# EasyEDA Pro project ProPrj_TD4-CPU_.epro, board TD4_CPU v1.1
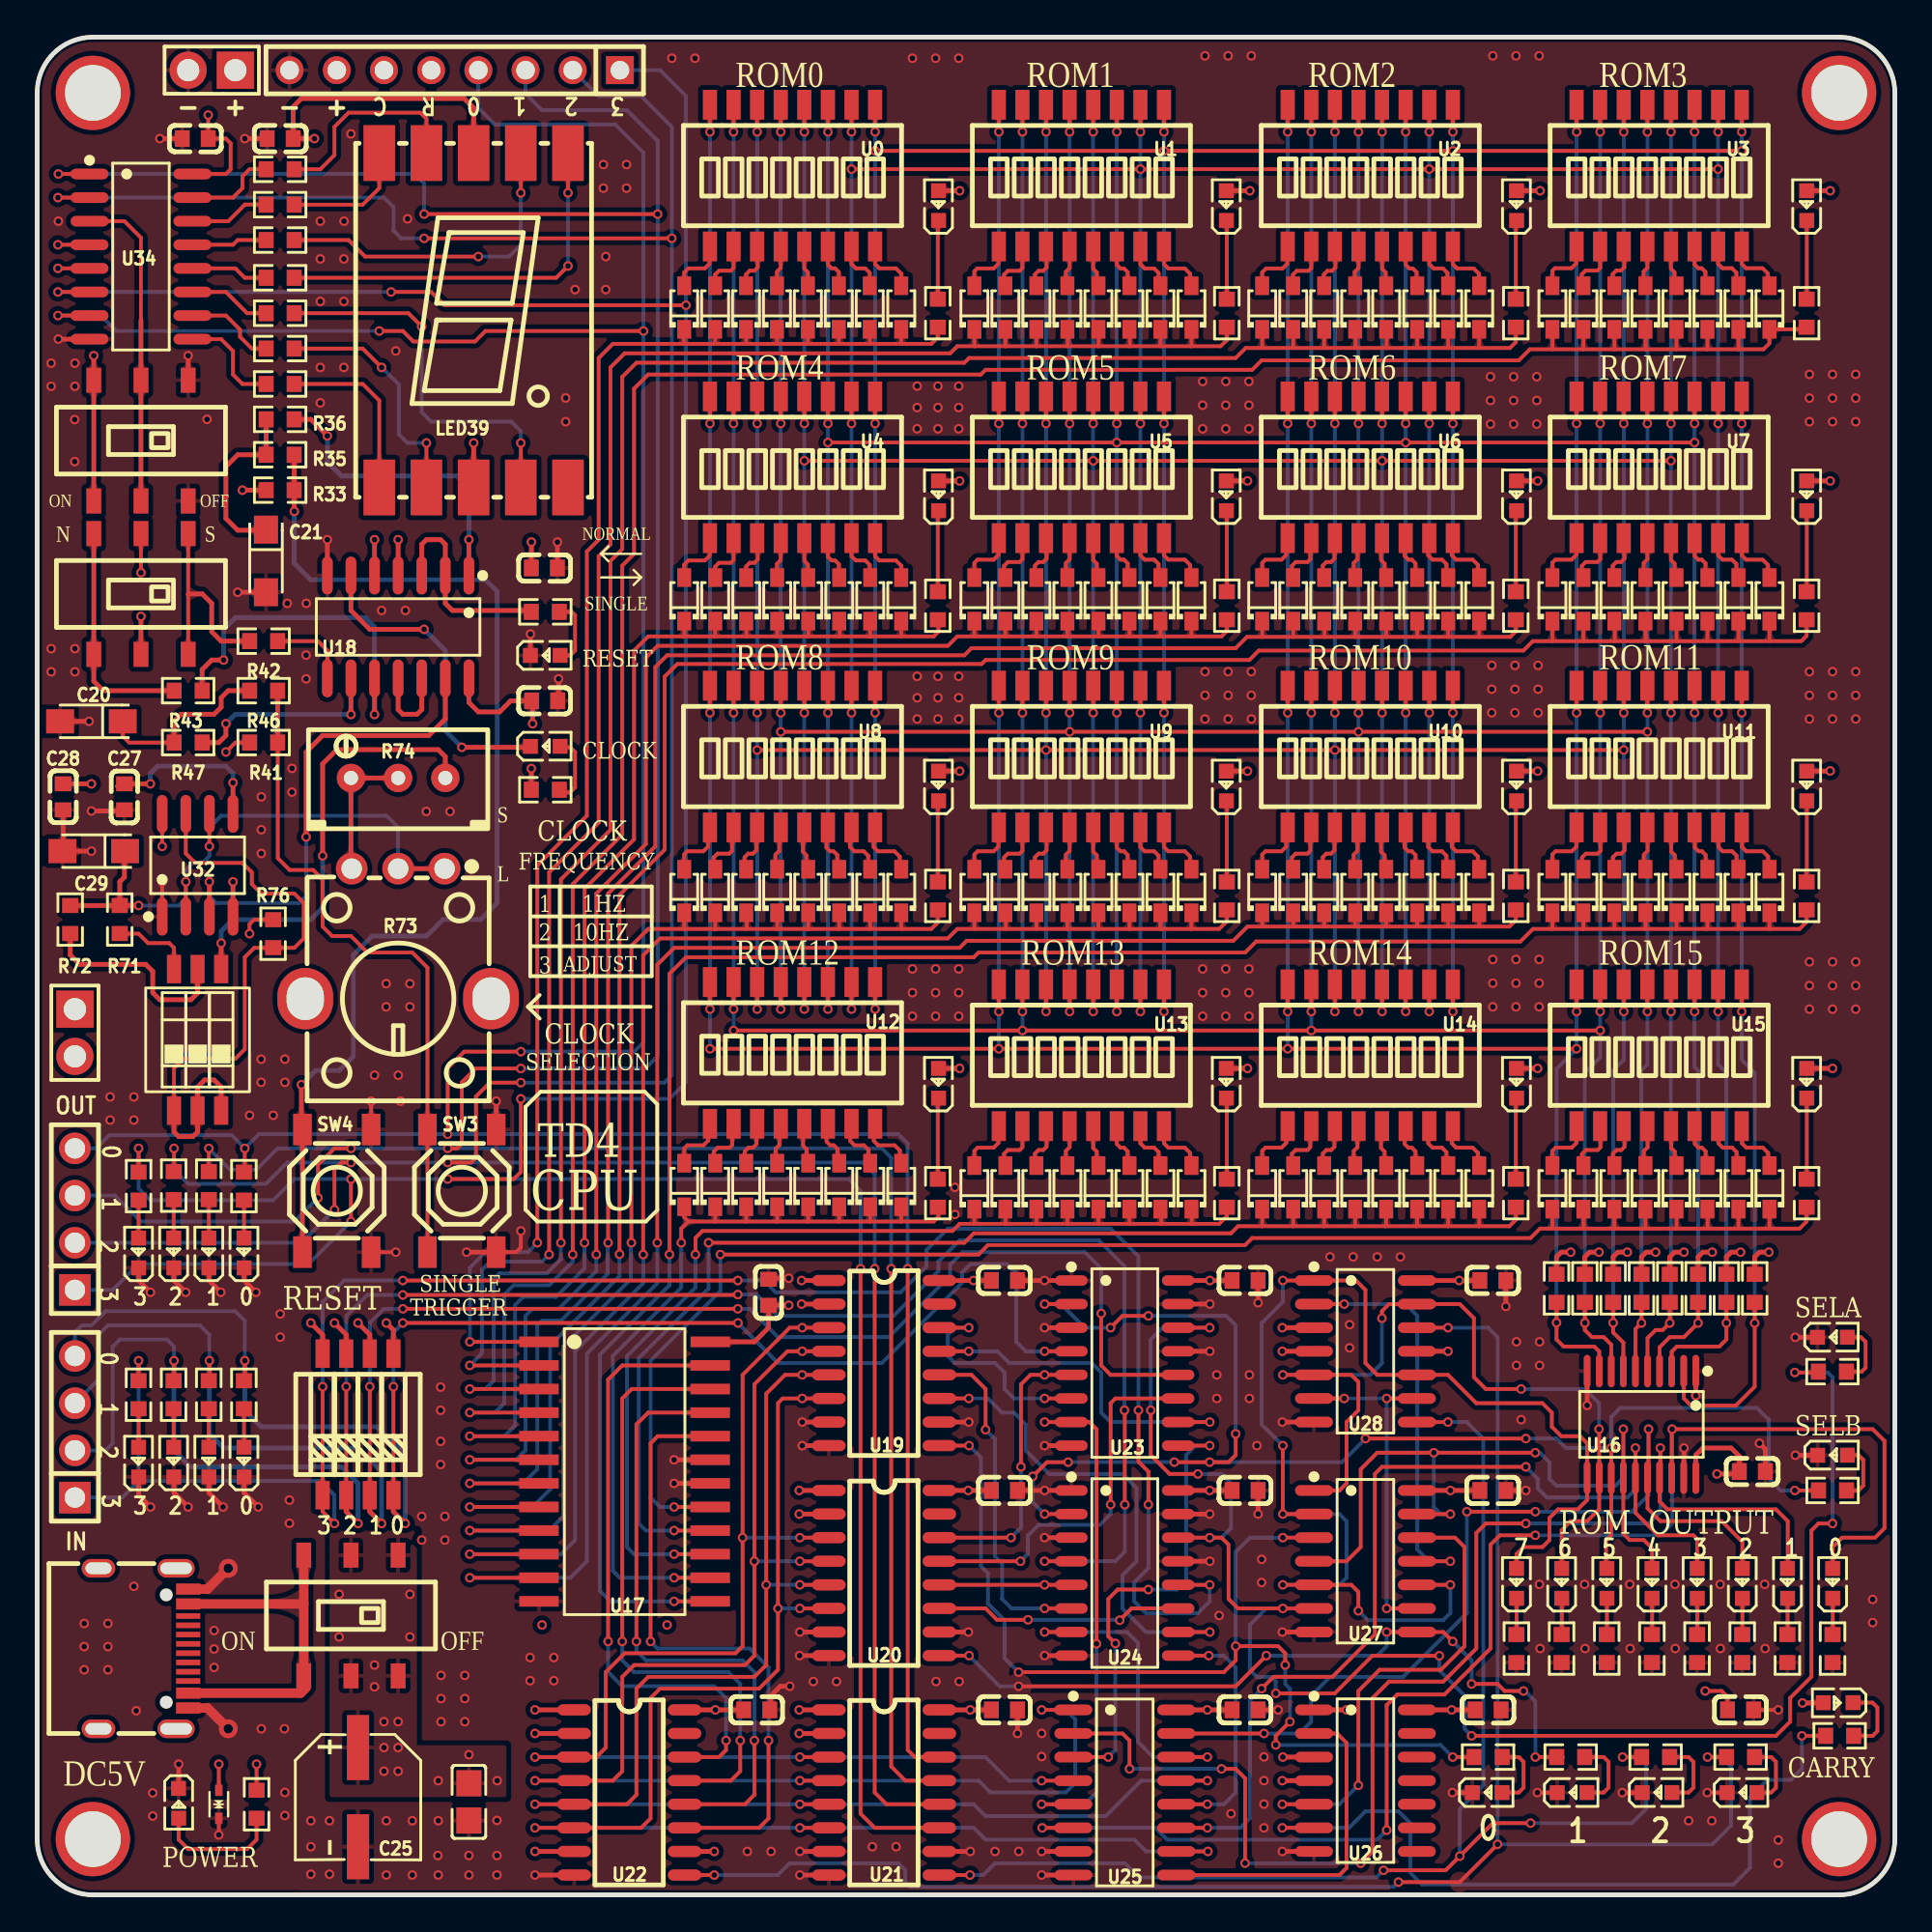
[diagram p3: board, top side]
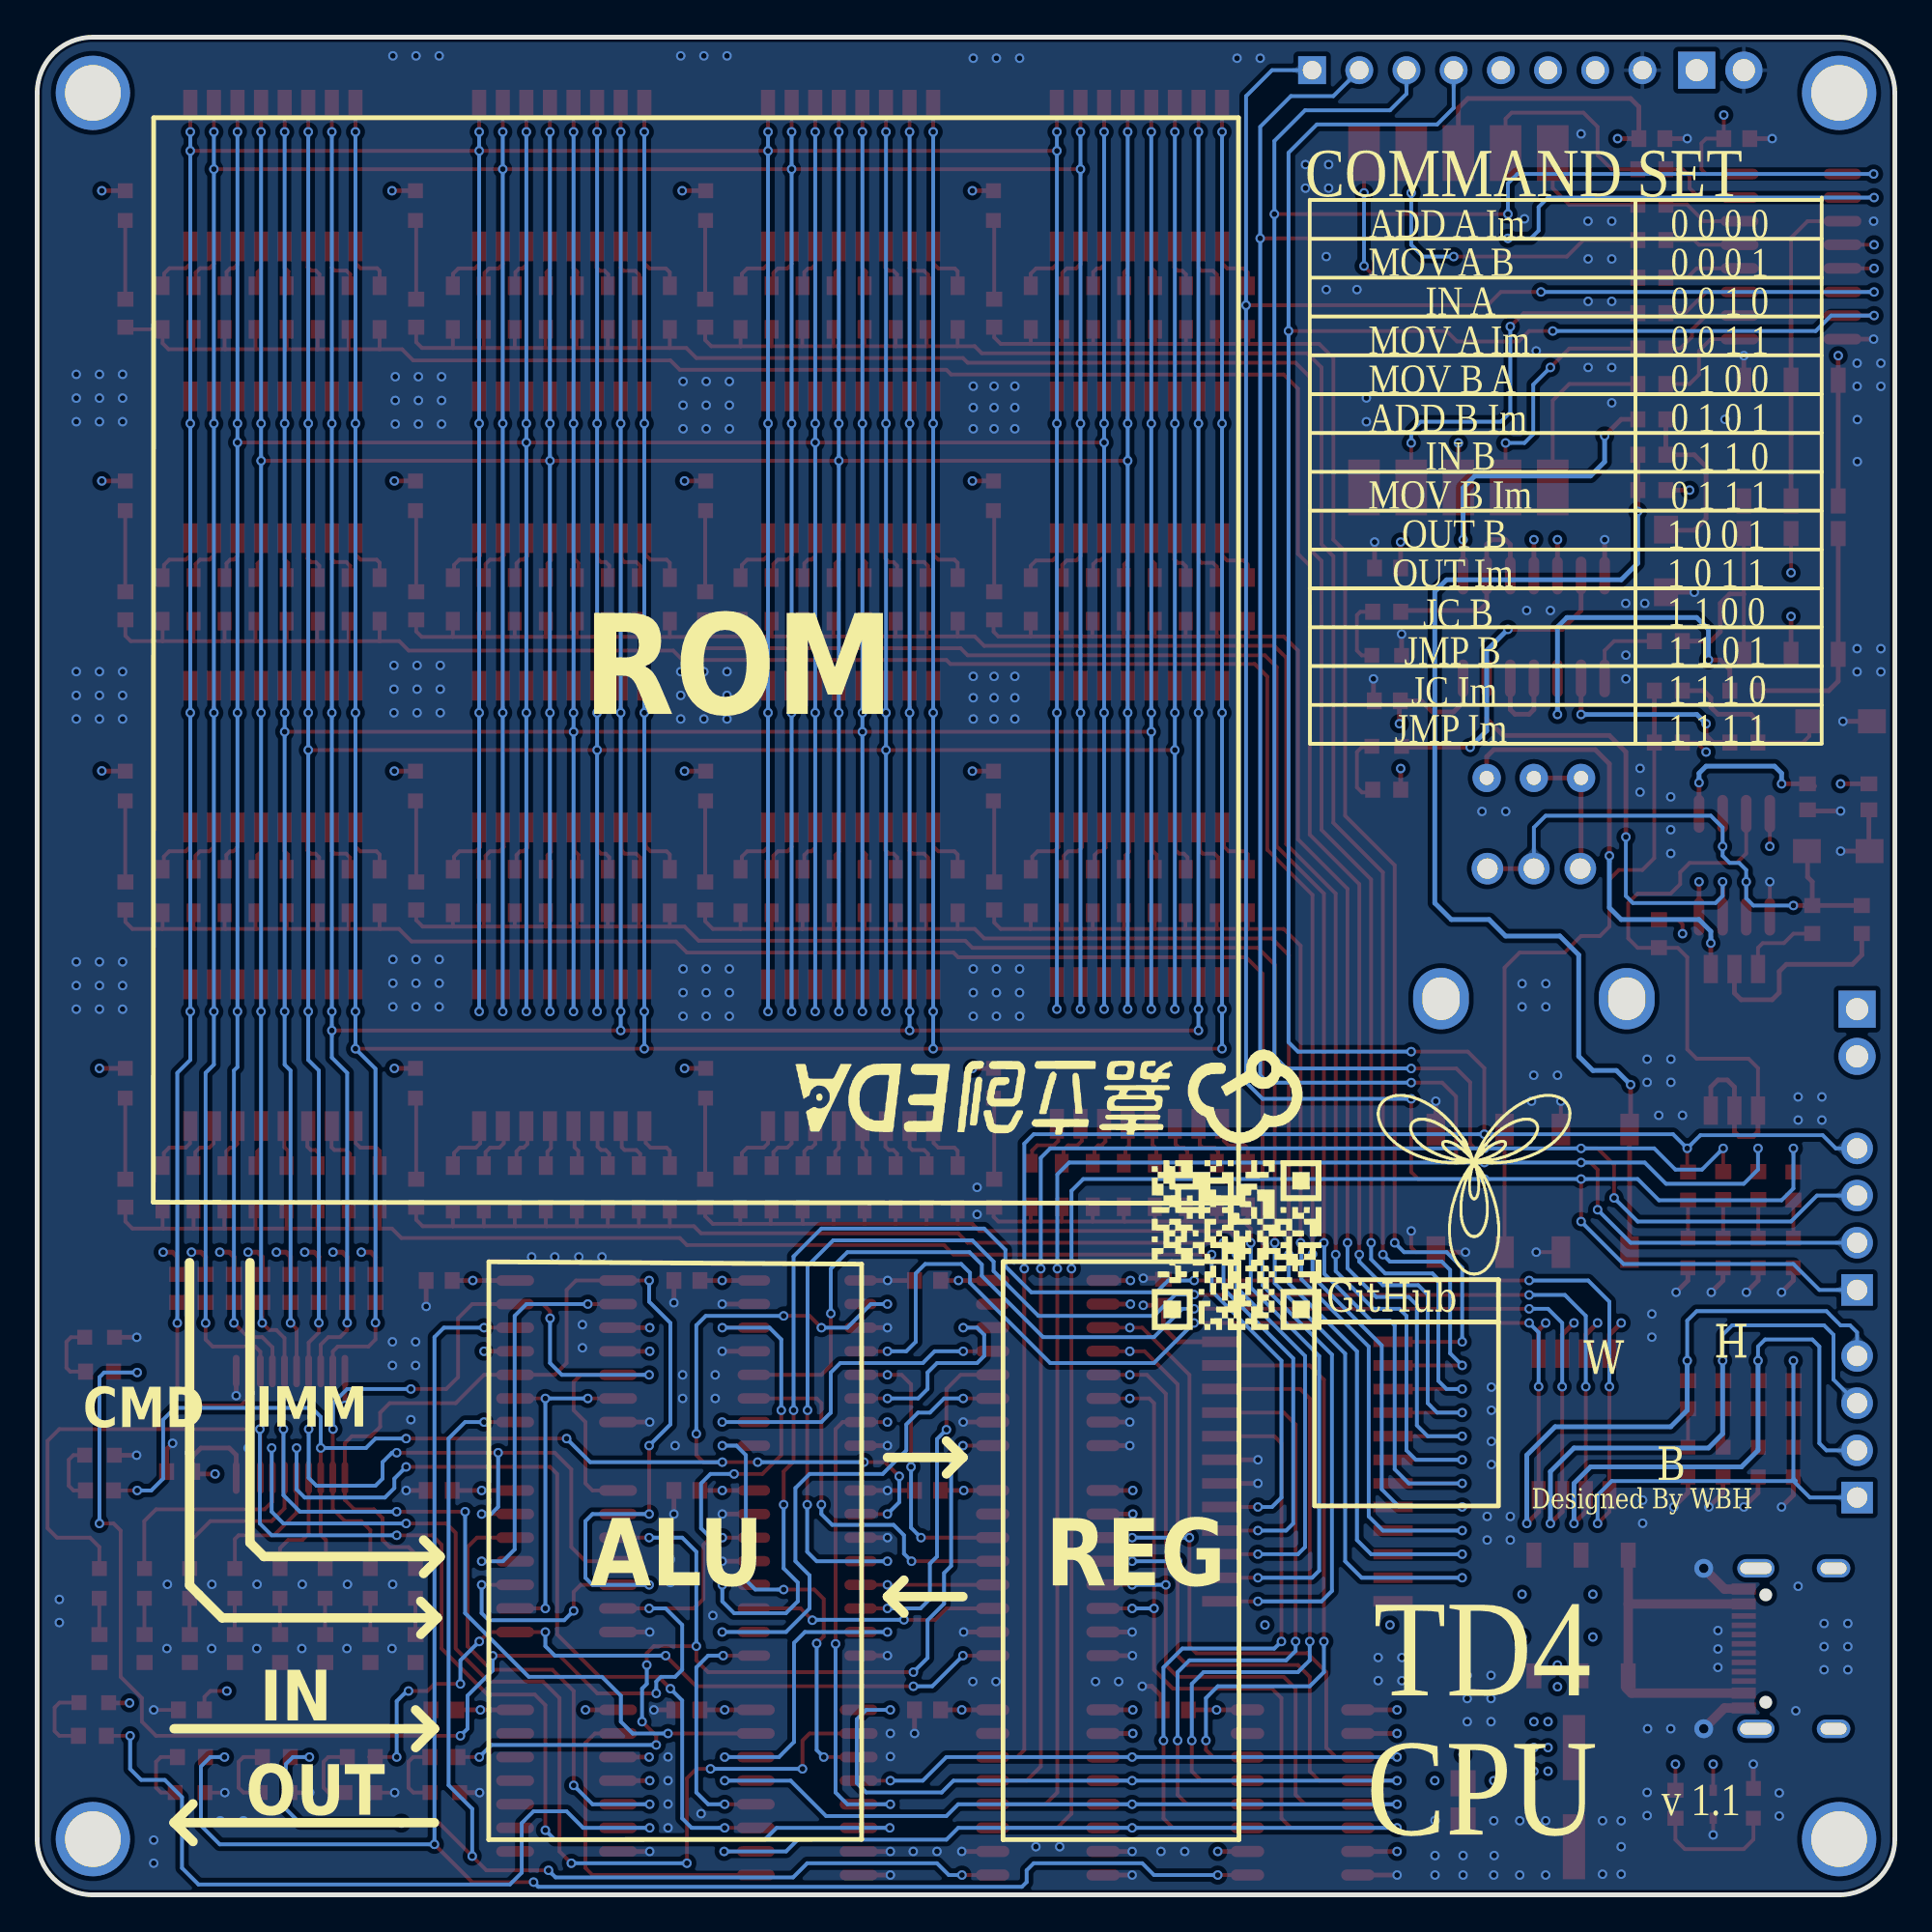
[diagram p4: board, bottom side, seen from below]

Outline 100 x 100 mm; copper layers: Top Layer, Inner1, Inner2, Bottom Layer. Coordinates in mm from the lower left corner of the outline.
Outline path: 0,97 0,3 arc(0.88,0.88) 3,0 97,0 arc(99.12,0.88) 100,3 100,97 arc(99.12,99.12) 97,100 3,100 arc(0.88,99.12) 0,97
Stack: Top Layer 0.035mm 外层铜厚1oz / Dielectric1 0.2104mm 7628 RC49% 8.6mil / Inner1 0.0152mm 内层铜厚 / Dielectric2 1.065mm 1.1mm H/HOZ Copper / Inner2 0.0152mm 内层铜厚 / Dielectric3 0.2104mm 7628 RC49% 8.6mil / Bottom Layer 0.035mm 外层铜厚1oz

## Design rules (mm)
template: 自定义配置
spacing copperThickness1oz (default): track to track 0.102, other pairs 0.152 to 0.3
spacing copperThickness2oz: track to track 0.203, other pairs 0.152 to 0.3
track width copperThickness1oz (default): min 0.127, default 0.254, max 2.54
track width copperThickness2oz: min 0.203, default 0.254, max 2.54
differential pair differentialPair (default): width min 0.127, default 0.254, max 2.54; gap min 0.152, default 0.152
via viaSize (default): diameter min 0.5, default 0.61, max 10; hole min 0.3, default 0.305, max 6.3

## Placement (name value [footprint] x y rotation side)
C1  100nF  [C0603]  39.37 32.44 90 top
C2  100nF  [C0603]  92.33 22.78 0 top
C3  100nF  [C0603]  52.07 33.07 0 top
C4  100nF  [C0603]  38.74 9.96 0 top
C5  100nF  [C0603]  52.07 21.77 0 top
C6  100nF  [C0603]  52.07 9.96 0 top
C7  100nF  [C0603]  65.02 33.07 0 top
C8  100nF  [C0603]  65.02 21.77 0 top
C9  100nF  [C0603]  65.02 9.96 0 top
C10  100nF  [C0603]  78.1 9.96 0 top
C11  100nF  [C0603]  78.36 21.77 0 top
C12  100nF  [C0603]  78.36 33.07 0 top
C13  100nF  [C0603]  13.08 94.54 180 top
C14  100nF  [C0603]  27.31 71.42 180 top
C15  100nF  [C0603]  8.51 94.54 180 top
C16  100nF  [C0603]  27.32 64.27 0 top
C20  10uF  [CAP-SMD_L3.2-W1.6-RD]  2.92 63.17 180 top
C21  10uF  [CAP-SMD_L3.2-W1.6-RD]  12.32 71.81 270 top
C24  100nF  [C0805]  23.24 5 90 top
C25  220UF  [CAP-SMD_BD6.3-L6.6-W6.6-LS7.2-FD]  17.27 5.26 270 top
C26  100nF  [C0603]  91.69 9.96 0 top
C27  10nF  [C0603]  4.7 59.11 90 top
C28  100nF  [C0603]  1.4 59.11 270 top
C29  10uF  [CAP-SMD_L3.2-W1.6-RD]  3.05 56.19 180 top
D1  1N5819WS  [SOD-323_L1.8-W1.3-LS2.5-RD]  34.83 85.44 90 top
D2  1N5819WS  [SOD-323_L1.8-W1.3-LS2.5-RD]  36.49 85.44 90 top
D3  1N5819WS  [SOD-323_L1.8-W1.3-LS2.5-RD]  38.16 85.44 90 top
D4  1N5819WS  [SOD-323_L1.8-W1.3-LS2.5-RD]  41.49 85.44 90 top
D5  1N5819WS  [SOD-323_L1.8-W1.3-LS2.5-RD]  39.82 85.44 90 top
D6  1N5819WS  [SOD-323_L1.8-W1.3-LS2.5-RD]  44.82 85.44 90 top
D7  1N5819WS  [SOD-323_L1.8-W1.3-LS2.5-RD]  43.15 85.44 90 top
D8  1N5819WS  [SOD-323_L1.8-W1.3-LS2.5-RD]  46.51 85.44 90 top
D9  1N5819WS  [SOD-323_L1.8-W1.3-LS2.5-RD]  50.45 85.44 90 top
D10  1N5819WS  [SOD-323_L1.8-W1.3-LS2.5-RD]  53.79 85.44 90 top
D11  1N5819WS  [SOD-323_L1.8-W1.3-LS2.5-RD]  52.12 85.44 90 top
D12  1N5819WS  [SOD-323_L1.8-W1.3-LS2.5-RD]  57.13 85.44 90 top
D13  1N5819WS  [SOD-323_L1.8-W1.3-LS2.5-RD]  55.46 85.44 90 top
D14  1N5819WS  [SOD-323_L1.8-W1.3-LS2.5-RD]  60.47 85.44 90 top
D15  1N5819WS  [SOD-323_L1.8-W1.3-LS2.5-RD]  58.8 85.44 90 top
D16  1N5819WS  [SOD-323_L1.8-W1.3-LS2.5-RD]  62.13 85.44 90 top
D17  1N5819WS  [SOD-323_L1.8-W1.3-LS2.5-RD]  65.94 85.44 90 top
D18  1N5819WS  [SOD-323_L1.8-W1.3-LS2.5-RD]  69.28 85.44 90 top
D19  1N5819WS  [SOD-323_L1.8-W1.3-LS2.5-RD]  67.61 85.44 90 top
D20  1N5819WS  [SOD-323_L1.8-W1.3-LS2.5-RD]  70.95 85.44 90 top
D21  1N5819WS  [SOD-323_L1.8-W1.3-LS2.5-RD]  72.62 85.44 90 top
D22  1N5819WS  [SOD-323_L1.8-W1.3-LS2.5-RD]  75.96 85.44 90 top
D23  1N5819WS  [SOD-323_L1.8-W1.3-LS2.5-RD]  74.29 85.44 90 top
D24  1N5819WS  [SOD-323_L1.8-W1.3-LS2.5-RD]  77.62 85.44 90 top
D25  1N5819WS  [SOD-323_L1.8-W1.3-LS2.5-RD]  81.57 85.44 90 top
D26  1N5819WS  [SOD-323_L1.8-W1.3-LS2.5-RD]  84.9 85.44 90 top
D27  1N5819WS  [SOD-323_L1.8-W1.3-LS2.5-RD]  83.24 85.44 90 top
D28  1N5819WS  [SOD-323_L1.8-W1.3-LS2.5-RD]  88.24 85.44 90 top
D29  1N5819WS  [SOD-323_L1.8-W1.3-LS2.5-RD]  86.57 85.44 90 top
D30  1N5819WS  [SOD-323_L1.8-W1.3-LS2.5-RD]  91.58 85.44 90 top
D31  1N5819WS  [SOD-323_L1.8-W1.3-LS2.5-RD]  89.91 85.44 90 top
D32  1N5819WS  [SOD-323_L1.8-W1.3-LS2.5-RD]  93.25 85.44 90 top
D33  1N5819WS  [SOD-323_L1.8-W1.3-LS2.5-RD]  34.83 69.74 90 top
D34  1N5819WS  [SOD-323_L1.8-W1.3-LS2.5-RD]  38.17 69.74 90 top
D35  1N5819WS  [SOD-323_L1.8-W1.3-LS2.5-RD]  36.5 69.74 90 top
D36  1N5819WS  [SOD-323_L1.8-W1.3-LS2.5-RD]  41.51 69.74 90 top
D37  1N5819WS  [SOD-323_L1.8-W1.3-LS2.5-RD]  39.84 69.74 90 top
D38  1N5819WS  [SOD-323_L1.8-W1.3-LS2.5-RD]  44.84 69.74 90 top
D39  1N5819WS  [SOD-323_L1.8-W1.3-LS2.5-RD]  43.18 69.74 90 top
D40  1N5819WS  [SOD-323_L1.8-W1.3-LS2.5-RD]  46.51 69.74 90 top
D41  1N5819WS  [SOD-323_L1.8-W1.3-LS2.5-RD]  50.45 69.74 90 top
D42  1N5819WS  [SOD-323_L1.8-W1.3-LS2.5-RD]  53.79 69.74 90 top
D43  1N5819WS  [SOD-323_L1.8-W1.3-LS2.5-RD]  52.12 69.74 90 top
D44  1N5819WS  [SOD-323_L1.8-W1.3-LS2.5-RD]  57.13 69.74 90 top
D45  1N5819WS  [SOD-323_L1.8-W1.3-LS2.5-RD]  55.46 69.74 90 top
D46  1N5819WS  [SOD-323_L1.8-W1.3-LS2.5-RD]  60.47 69.74 90 top
D47  1N5819WS  [SOD-323_L1.8-W1.3-LS2.5-RD]  58.8 69.74 90 top
D48  1N5819WS  [SOD-323_L1.8-W1.3-LS2.5-RD]  62.13 69.74 90 top
D49  1N5819WS  [SOD-323_L1.8-W1.3-LS2.5-RD]  65.94 69.74 90 top
D50  1N5819WS  [SOD-323_L1.8-W1.3-LS2.5-RD]  69.28 69.74 90 top
D51  1N5819WS  [SOD-323_L1.8-W1.3-LS2.5-RD]  67.61 69.74 90 top
D52  1N5819WS  [SOD-323_L1.8-W1.3-LS2.5-RD]  72.62 69.74 90 top
D53  1N5819WS  [SOD-323_L1.8-W1.3-LS2.5-RD]  70.95 69.74 90 top
D54  1N5819WS  [SOD-323_L1.8-W1.3-LS2.5-RD]  75.96 69.74 90 top
D55  1N5819WS  [SOD-323_L1.8-W1.3-LS2.5-RD]  74.29 69.74 90 top
D56  1N5819WS  [SOD-323_L1.8-W1.3-LS2.5-RD]  77.62 69.74 90 top
D57  1N5819WS  [SOD-323_L1.8-W1.3-LS2.5-RD]  81.57 69.74 90 top
D58  1N5819WS  [SOD-323_L1.8-W1.3-LS2.5-RD]  83.24 69.74 90 top
D59  1N5819WS  [SOD-323_L1.8-W1.3-LS2.5-RD]  84.9 69.74 90 top
D60  1N5819WS  [SOD-323_L1.8-W1.3-LS2.5-RD]  88.24 69.74 90 top
D61  1N5819WS  [SOD-323_L1.8-W1.3-LS2.5-RD]  86.57 69.74 90 top
D62  1N5819WS  [SOD-323_L1.8-W1.3-LS2.5-RD]  91.58 69.74 90 top
D63  1N5819WS  [SOD-323_L1.8-W1.3-LS2.5-RD]  89.91 69.74 90 top
D64  1N5819WS  [SOD-323_L1.8-W1.3-LS2.5-RD]  93.25 69.74 90 top
D65  1N5819WS  [SOD-323_L1.8-W1.3-LS2.5-RD]  34.83 54.04 90 top
D66  1N5819WS  [SOD-323_L1.8-W1.3-LS2.5-RD]  38.17 54.04 90 top
D67  1N5819WS  [SOD-323_L1.8-W1.3-LS2.5-RD]  36.5 54.04 90 top
D68  1N5819WS  [SOD-323_L1.8-W1.3-LS2.5-RD]  39.84 54.04 90 top
D69  1N5819WS  [SOD-323_L1.8-W1.3-LS2.5-RD]  41.51 54.04 90 top
D70  1N5819WS  [SOD-323_L1.8-W1.3-LS2.5-RD]  43.18 54.04 90 top
D71  1N5819WS  [SOD-323_L1.8-W1.3-LS2.5-RD]  44.84 54.04 90 top
D72  1N5819WS  [SOD-323_L1.8-W1.3-LS2.5-RD]  46.51 54.04 90 top
D73  1N5819WS  [SOD-323_L1.8-W1.3-LS2.5-RD]  50.45 54.04 90 top
D74  1N5819WS  [SOD-323_L1.8-W1.3-LS2.5-RD]  53.79 54.04 90 top
D75  1N5819WS  [SOD-323_L1.8-W1.3-LS2.5-RD]  52.12 54.04 90 top
D76  1N5819WS  [SOD-323_L1.8-W1.3-LS2.5-RD]  57.13 54.04 90 top
D77  1N5819WS  [SOD-323_L1.8-W1.3-LS2.5-RD]  55.46 54.04 90 top
D78  1N5819WS  [SOD-323_L1.8-W1.3-LS2.5-RD]  60.47 54.04 90 top
D79  1N5819WS  [SOD-323_L1.8-W1.3-LS2.5-RD]  58.8 54.04 90 top
D80  1N5819WS  [SOD-323_L1.8-W1.3-LS2.5-RD]  62.13 54.04 90 top
D81  1N5819WS  [SOD-323_L1.8-W1.3-LS2.5-RD]  65.94 54.04 90 top
D82  1N5819WS  [SOD-323_L1.8-W1.3-LS2.5-RD]  69.28 54.04 90 top
D83  1N5819WS  [SOD-323_L1.8-W1.3-LS2.5-RD]  67.61 54.04 90 top
D84  1N5819WS  [SOD-323_L1.8-W1.3-LS2.5-RD]  72.62 54.04 90 top
D85  1N5819WS  [SOD-323_L1.8-W1.3-LS2.5-RD]  70.95 54.04 90 top
D86  1N5819WS  [SOD-323_L1.8-W1.3-LS2.5-RD]  75.96 54.04 90 top
D87  1N5819WS  [SOD-323_L1.8-W1.3-LS2.5-RD]  74.29 54.04 90 top
D88  1N5819WS  [SOD-323_L1.8-W1.3-LS2.5-RD]  77.62 54.04 90 top
D89  1N5819WS  [SOD-323_L1.8-W1.3-LS2.5-RD]  81.57 54.04 90 top
D90  1N5819WS  [SOD-323_L1.8-W1.3-LS2.5-RD]  84.9 54.04 90 top
D91  1N5819WS  [SOD-323_L1.8-W1.3-LS2.5-RD]  83.24 54.04 90 top
D92  1N5819WS  [SOD-323_L1.8-W1.3-LS2.5-RD]  88.24 54.04 90 top
D93  1N5819WS  [SOD-323_L1.8-W1.3-LS2.5-RD]  86.57 54.04 90 top
D94  1N5819WS  [SOD-323_L1.8-W1.3-LS2.5-RD]  91.58 54.04 90 top
D95  1N5819WS  [SOD-323_L1.8-W1.3-LS2.5-RD]  89.91 54.04 90 top
D96  1N5819WS  [SOD-323_L1.8-W1.3-LS2.5-RD]  93.25 54.04 90 top
D97  1N5819WS  [SOD-323_L1.8-W1.3-LS2.5-RD]  34.83 38.21 90 top
D98  1N5819WS  [SOD-323_L1.8-W1.3-LS2.5-RD]  38.17 38.21 90 top
D99  1N5819WS  [SOD-323_L1.8-W1.3-LS2.5-RD]  36.5 38.21 90 top
D100  1N5819WS  [SOD-323_L1.8-W1.3-LS2.5-RD]  41.51 38.21 90 top
D101  1N5819WS  [SOD-323_L1.8-W1.3-LS2.5-RD]  39.84 38.21 90 top
D102  1N5819WS  [SOD-323_L1.8-W1.3-LS2.5-RD]  44.84 38.21 90 top
D103  1N5819WS  [SOD-323_L1.8-W1.3-LS2.5-RD]  43.18 38.21 90 top
D104  1N5819WS  [SOD-323_L1.8-W1.3-LS2.5-RD]  46.51 38.21 90 top
D105  1N5819WS  [SOD-323_L1.8-W1.3-LS2.5-RD]  50.45 38.08 90 top
D106  1N5819WS  [SOD-323_L1.8-W1.3-LS2.5-RD]  53.79 38.08 90 top
D107  1N5819WS  [SOD-323_L1.8-W1.3-LS2.5-RD]  52.12 38.08 90 top
D108  1N5819WS  [SOD-323_L1.8-W1.3-LS2.5-RD]  57.13 38.08 90 top
D109  1N5819WS  [SOD-323_L1.8-W1.3-LS2.5-RD]  55.46 38.08 90 top
D110  1N5819WS  [SOD-323_L1.8-W1.3-LS2.5-RD]  58.8 38.08 90 top
D111  1N5819WS  [SOD-323_L1.8-W1.3-LS2.5-RD]  60.47 38.08 90 top
D112  1N5819WS  [SOD-323_L1.8-W1.3-LS2.5-RD]  62.13 38.08 90 top
D113  1N5819WS  [SOD-323_L1.8-W1.3-LS2.5-RD]  65.94 38.08 90 top
D114  1N5819WS  [SOD-323_L1.8-W1.3-LS2.5-RD]  69.28 38.08 90 top
D115  1N5819WS  [SOD-323_L1.8-W1.3-LS2.5-RD]  67.61 38.08 90 top
D116  1N5819WS  [SOD-323_L1.8-W1.3-LS2.5-RD]  70.95 38.08 90 top
D117  1N5819WS  [SOD-323_L1.8-W1.3-LS2.5-RD]  72.62 38.08 90 top
D118  1N5819WS  [SOD-323_L1.8-W1.3-LS2.5-RD]  75.96 38.08 90 top
D119  1N5819WS  [SOD-323_L1.8-W1.3-LS2.5-RD]  74.29 38.08 90 top
D120  1N5819WS  [SOD-323_L1.8-W1.3-LS2.5-RD]  77.62 38.08 90 top
D121  1N5819WS  [SOD-323_L1.8-W1.3-LS2.5-RD]  81.57 38.08 90 top
D122  1N5819WS  [SOD-323_L1.8-W1.3-LS2.5-RD]  84.9 38.08 90 top
D123  1N5819WS  [SOD-323_L1.8-W1.3-LS2.5-RD]  83.24 38.08 90 top
D124  1N5819WS  [SOD-323_L1.8-W1.3-LS2.5-RD]  88.24 38.08 90 top
D125  1N5819WS  [SOD-323_L1.8-W1.3-LS2.5-RD]  86.57 38.08 90 top
D126  1N5819WS  [SOD-323_L1.8-W1.3-LS2.5-RD]  89.91 38.08 90 top
D127  1N5819WS  [SOD-323_L1.8-W1.3-LS2.5-RD]  91.58 38.08 90 top
D128  1N5819WS  [SOD-323_L1.8-W1.3-LS2.5-RD]  93.25 38.08 90 top
D129  TVS  [SOD-523_L1.2-W0.8-LS1.6-BI]  9.78 4.88 270 top
H1  PZ254V-11-04P  [HDR-TH_4P-P2.54-V-M]  2.03 25.2 90 top
H2  PZ254V-11-02P  [HDR-TH_2P-P2.54-V-M]  2.03 46.41 270 top
H3  PZ254V-11-04P  [HDR-TH_4P-P2.54-V-M]  2.03 36.37 90 top
H5  PZ254V-11-08P  [HDR-TH_8P-P2.54-V-M]  22.48 98.22 180 top
H6  PZ254V-11-02P  [HDR-TH_2P-P2.54-V-M]  9.4 98.22 180 top
LED0  YLED0603G  [LED_0603]  96.65 16.81 90 top
LED1  YLED0603G  [LED_0603]  94.22 16.81 90 top
LED2  YLED0603G  [LED_0603]  91.78 16.81 90 top
LED3  YLED0603G  [LED_0603]  89.35 16.81 90 top
LED4  YLED0603G  [LED_0603]  86.92 16.81 90 top
LED5  YLED0603G  [LED_0603]  84.49 16.81 90 top
LED6  YLED0603G  [LED_0603]  82.06 16.81 90 top
LED7  YLED0603G  [LED_0603]  79.63 16.81 90 top
LED8  YLED0603G  [LED_0603]  48.51 90.98 90 top
LED9  YLED0603G  [LED_0603]  64.01 90.98 90 top
LED10  YLED0603G  [LED_0603]  79.63 90.98 90 top
LED11  YLED0603G  [LED_0603]  95.25 90.98 90 top
LED12  YLED0603G  [LED_0603]  48.51 75.36 90 top
LED13  YLED0603G  [LED_0603]  64.01 75.36 90 top
LED14  YLED0603G  [LED_0603]  79.63 75.36 90 top
LED15  YLED0603G  [LED_0603]  95.25 75.36 90 top
LED16  YLED0603G  [LED_0603]  48.51 59.74 90 top
LED17  YLED0603G  [LED_0603]  64.01 59.74 90 top
LED18  YLED0603G  [LED_0603]  79.63 59.74 90 top
LED19  YLED0603G  [LED_0603]  95.25 59.74 90 top
LED20  YLED0603G  [LED_0603]  48.51 43.74 90 top
LED21  YLED0603G  [LED_0603]  64.01 43.74 90 top
LED22  YLED0603G  [LED_0603]  79.63 43.74 90 top
LED23  YLED0603G  [LED_0603]  95.25 43.74 90 top
LED24  YLED0603R  [LED_0603]  96.9 10.34 180 top
LED25  YLED0603B  [LED_0603]  78.1 5.51 0 top
LED26  YLED0603B  [LED_0603]  82.68 5.51 0 top
LED27  YLED0603B  [LED_0603]  87.25 5.51 0 top
LED28  YLED0603B  [LED_0603]  91.82 5.51 0 top
LED29  YLED0603B  [LED_0603]  96.69 30.02 0 top
LED30  YLED0603B  [LED_0603]  96.69 23.67 0 top
LED31  YLED0603R  [LED_0603]  11.13 23.34 90 top
LED32  YLED0603R  [LED_0603]  9.24 23.34 90 top
LED33  YLED0603R  [LED_0603]  7.35 23.34 90 top
LED34  YLED0603R  [LED_0603]  5.45 23.34 90 top
LED35  YLED0603R  [LED_0603]  11.13 34.6 90 top
LED36  YLED0603R  [LED_0603]  9.24 34.6 90 top
LED37  YLED0603R  [LED_0603]  7.35 34.6 90 top
LED38  YLED0603R  [LED_0603]  5.45 34.6 90 top
LED39  SLS0561FR1A1GD  [LED-SEG-SMD_SLS0561FR1A1GD]  23.5 84.76 0 top
LED40  YLED0603B  [LED_0603]  27.4 66.73 0 top
LED41  YLED0603B  [LED_0603]  27.4 61.83 0 top
LED42  YLED0603R  [LED_0603]  7.62 4.88 270 top
NOREF  -  [Pad_e860]  97 97 0 top
NOREF#2  -  [Pad_e862]  3 3 0 top
NOREF#3  -  [Pad_e859]  3 97 0 top
NOREF#4  -  [Pad_e861]  97 3 0 top
R1  10kΩ  [R0603]  81.79 32.65 90 top
R2  10kΩ  [R0603]  83.31 32.65 90 top
R3  10kΩ  [R0603]  84.84 32.65 90 top
R4  10kΩ  [R0603]  86.36 32.65 90 top
R5  10kΩ  [R0603]  87.88 32.65 90 top
R6  10kΩ  [R0603]  89.41 32.65 90 top
R7  10kΩ  [R0603]  90.93 32.65 90 top
R8  10kΩ  [R0603]  92.46 32.65 90 top
R9  4.7kΩ  [R0603]  96.65 13.26 90 top
R10  4.7kΩ  [R0603]  94.22 13.26 90 top
R11  4.7kΩ  [R0603]  91.78 13.26 90 top
R12  4.7kΩ  [R0603]  89.35 13.26 90 top
R13  4.7kΩ  [R0603]  86.92 13.26 90 top
R14  4.7kΩ  [R0603]  84.49 13.26 90 top
R15  4.7kΩ  [R0603]  82.06 13.26 90 top
R16  4.7kΩ  [R0603]  79.63 13.26 90 top
R17  10kΩ  [R0603]  48.48 85.14 90 top
R18  10kΩ  [R0603]  64.04 85.14 90 top
R19  10kΩ  [R0603]  79.6 85.14 90 top
R20  10kΩ  [R0603]  95.25 85.14 90 top
R21  10kΩ  [R0603]  48.48 69.39 90 top
R22  10kΩ  [R0603]  64.04 69.39 90 top
R23  10kΩ  [R0603]  79.6 69.39 90 top
R24  10kΩ  [R0603]  95.25 69.39 90 top
R25  10kΩ  [R0603]  48.48 53.77 90 top
R26  10kΩ  [R0603]  64.04 53.77 90 top
R27  10kΩ  [R0603]  79.6 53.77 90 top
R28  10kΩ  [R0603]  95.25 53.77 90 top
R29  10kΩ  [R0603]  48.48 37.77 90 top
R30  10kΩ  [R0603]  64.04 37.77 90 top
R31  10kΩ  [R0603]  79.6 37.77 90 top
R32  10kΩ  [R0603]  95.25 37.77 90 top
R33  1kΩ  [R0603]  13.08 75.62 180 top
R34  4.7kΩ  [R0603]  27.35 69.07 0 top
R35  100kΩ  [R0603]  13.08 77.52 180 top
R36  100kΩ  [R0603]  13.08 79.43 0 top
R38  4.7kΩ  [R0603]  27.35 59.49 0 top
R41  1kΩ  [R0603]  12.19 62.03 180 top
R42  4.7kΩ  [R0603]  12.19 67.49 0 top
R43  4.7kΩ  [R0603]  8.13 64.82 0 top
R46  10kΩ  [R0603]  12.19 64.82 180 top
R47  100kΩ  [R0603]  8.13 62.03 0 top
R48  4.7kΩ  [R0603]  11.81 4.88 90 top
R49  4.7kΩ  [R0603]  97.03 8.56 180 top
R50  4.7kΩ  [R0603]  78.1 7.42 180 top
R51  4.7kΩ  [R0603]  82.55 7.42 180 top
R52  4.7kΩ  [R0603]  87.12 7.42 180 top
R53  4.7kΩ  [R0603]  91.69 7.42 180 top
R54  4.7kΩ  [R0603]  96.64 28.16 0 top
R55  4.7kΩ  [R0603]  96.65 21.77 0 top
R56  4.7kΩ  [R0603]  11.13 26.92 270 top
R57  4.7kΩ  [R0603]  9.24 26.92 270 top
R58  4.7kΩ  [R0603]  7.35 26.92 270 top
R59  4.7kΩ  [R0603]  5.45 26.92 270 top
R60  4.7kΩ  [R0603]  11.13 38.15 270 top
R61  4.7kΩ  [R0603]  9.24 38.18 270 top
R62  4.7kΩ  [R0603]  7.35 38.18 270 top
R63  4.7kΩ  [R0603]  5.46 38.15 270 top
R64  4.7kΩ  [R0603]  13.08 92.89 0 top
R65  4.7kΩ  [R0603]  13.08 90.98 0 top
R66  4.7kΩ  [R0603]  13.08 81.33 0 top
R67  4.7kΩ  [R0603]  13.08 83.24 0 top
R68  4.7kΩ  [R0603]  13.08 85.14 0 top
R69  4.7kΩ  [R0603]  13.08 87.05 0 top
R70  4.7kΩ  [R0603]  13.08 89.08 0 top
R71  75kΩ  [R0603]  4.44 52.5 90 top
R72  7.5kΩ  [R0603]  1.78 52.5 90 top
R73  50kΩ  [RES-TH_RK09K1130AAU]  19.43 51.74 180 top
R74  10kΩ  [RES-ADJ-TH_3296W]  19.43 60.12 90 top
R76  1K  [R0603]  12.7 51.74 270 top
SW1  SS-3235S-L3  [SW-SMD_SS-3235S-L3.00]  5.59 78.28 0 top
SW2  SS-3235S-L3  [SW-SMD_SS-3235S-L3.00]  5.59 70.03 0 top
SW3  TS-1187A-B-A-B  [SW-SMD_4P-L5.1-W5.1-P3.70-LS6.5-TL-2]  22.86 37.9 90 top
SW4  TS-1187A-B-A-B  [SW-SMD_4P-L5.1-W5.1-P3.70-LS6.5-TL-2]  16.13 37.9 90 top
SW5  SS-3235S-L3  [SW-SMD_SS-3235S-L3.00]  16.89 15.04 0 top
U0  SMXMS-08K-TR  [SW-SMD_16P-L11.7-W5.4-P1.27-LS8.5_1]  40.66 92.55 0 top
U1  SMXMS-08K-TR  [SW-SMD_16P-L11.7-W5.4-P1.27-LS8.5_1]  56.21 92.55 0 top
U2  SMXMS-08K-TR  [SW-SMD_16P-L11.7-W5.4-P1.27-LS8.5_1]  71.76 92.55 0 top
U3  SMXMS-08K-TR  [SW-SMD_16P-L11.7-W5.4-P1.27-LS8.5_1]  87.31 92.55 0 top
U4  SMXMS-08K-TR  [SW-SMD_16P-L11.7-W5.4-P1.27-LS8.5_1]  40.66 76.85 0 top
U5  SMXMS-08K-TR  [SW-SMD_16P-L11.7-W5.4-P1.27-LS8.5_1]  56.21 76.85 0 top
U6  SMXMS-08K-TR  [SW-SMD_16P-L11.7-W5.4-P1.27-LS8.5_1]  71.76 76.85 0 top
U7  SMXMS-08K-TR  [SW-SMD_16P-L11.7-W5.4-P1.27-LS8.5_1]  87.31 76.85 0 top
U8  SMXMS-08K-TR  [SW-SMD_16P-L11.7-W5.4-P1.27-LS8.5_1]  40.66 61.28 0 top
U9  SMXMS-08K-TR  [SW-SMD_16P-L11.7-W5.4-P1.27-LS8.5_1]  56.21 61.28 0 top
U10  SMXMS-08K-TR  [SW-SMD_16P-L11.7-W5.4-P1.27-LS8.5_1]  71.76 61.28 0 top
U11  SMXMS-08K-TR  [SW-SMD_16P-L11.7-W5.4-P1.27-LS8.5_1]  87.31 61.28 0 top
U12  SMXMS-08K-TR  [SW-SMD_16P-L11.7-W5.4-P1.27-LS8.5_1]  40.66 45.32 0 top
U13  SMXMS-08K-TR  [SW-SMD_16P-L11.7-W5.4-P1.27-LS8.5_1]  56.21 45.2 0 top
U14  SMXMS-08K-TR  [SW-SMD_16P-L11.7-W5.4-P1.27-LS8.5_1]  71.76 45.2 0 top
U15  SMXMS-08K-TR  [SW-SMD_16P-L11.7-W5.4-P1.27-LS8.5_1]  87.31 45.2 0 top
U16  SN74HC540PWR  [TSSOP-20_L6.5-W4.4-P0.65-LS6.4-BL]  86.36 25.32 180 top
U17  SN74HC154DR(LX)  [SOP-24_L15.2-W7.5-P1.27-LS10.3-BL]  31.62 22.78 270 top
U18  74HC14  [SOIC-14_L8.7-W3.9-P1.27-LS6.0-BL]  19.43 68.25 180 top
U19  74HC161S  [SOIC-16_L9.9-W3.9-P1.27-LS6.0-BL-1]  45.59 28.63 270 top
U20  74HC161S  [SOIC-16_L9.9-W3.9-P1.27-LS6.0-BL-1]  45.59 17.32 270 top
U21  74HC161S  [SOIC-16_L9.9-W3.9-P1.27-LS6.0-BL-1]  45.59 5.51 270 top
U22  74HC161S  [SOIC-16_L9.9-W3.9-P1.27-LS6.0-BL-1]  31.88 5.51 270 top
U23  74HC153NS16ARDQ  [SOP-16_L10.0-W3.9-P1.27-LS6.0-BL]  58.55 28.63 270 top
U24  74HC153NS16ARDQ  [SOP-16_L10.0-W3.9-P1.27-LS6.0-BL]  58.55 17.32 270 top
U25  SN74HC283DR(LX)  [SOP-16_L9.9-W3.9-P1.27-LS6.0-BL]  58.55 5.51 270 top
U26  SN74HC74DR  [SOIC-14_L8.7-W3.9-P1.27-LS6.0-BL]  71.5 6.15 270 top
U27  SN74HC32DR  [SOIC-14_L8.7-W3.9-P1.27-LS6.0-BL]  71.5 17.96 270 top
U28  SN74HC10DR  [SOIC-14_L8.7-W3.9-P1.27-LS6.0-BL]  71.5 29.26 270 top
U29  DSHP04TSGER  [SW-SMD_8P-L6.7-W5.4-P1.27-LS8.4]  17.27 25.32 0 top
U32  NE555  [SOP-8_L5.0-W4.0-P1.27-LS6.0-BL]  8.64 55.42 0 top
U33  DSHP03TSGER  [SW-SMD_6P-L5.4-W5.4-P1.27-LS8.4]  8.64 46.03 0 top
U34  SN74LS247DR  [SOP-16_L9.9-W3.9-P1.27-LS6.0-BL]  5.59 88.19 270 top
USB2  KH-TYPE-C-16P  [USB-C-SMD_KH-TYPE-C-16P]  5.72 13.26 270 top

## Footprints (pads in the part's own frame, mm; a bottom-side part is the same pattern mirrored in y, then rotated)
C0603
  rect 0.8x0.9 smd: 1(-0.7,0) 2(0.7,0)
C0805
  rect 1.41x1.35 smd: 1(-1,0) 2(1,0)
CAP-SMD_BD6.3-L6.6-W6.6-LS7.2-FD
  rect 3.5x1.2 smd: 1(-2.67,0) 2(2.67,0)
CAP-SMD_L3.2-W1.6-RD
  rect 1.5x1.296 smd: 1(-1.687,0) 2(1.687,0)
HDR-TH_2P-P2.54-V-M
  rect 2x2 hole 1.2: 1(-1.27,0)
  round 2 hole 1.2: 2(1.27,0)
HDR-TH_4P-P2.54-V-M
  rect 1.7x1.7 hole 1.1: 1(-3.81,0)
  round 1.7 hole 1.1: 2(-1.27,0) 3(1.27,0) 4(3.81,0)
HDR-TH_8P-P2.54-V-M
  rect 1.5x1.5 hole 1: 1(-8.89,0)
  round 1.5 hole 1: 2(-6.35,0) 3(-3.81,0) 4(-1.27,0) 5(1.27,0) 6(3.81,0) 7(6.35,0) 8(8.89,0)
LED-SEG-SMD_SLS0561FR1A1GD
  rect 1.7x3 smd: 1(-5.08,-9) 2(-2.54,-9) 3(0,-9) 4(2.54,-9) 5(5.08,-9) 6(5.08,9) 7(2.54,9) 8(0,9) 9(-2.54,9) 10(-5.08,9)
LED_0603
  rect 0.8x0.8 smd: 1(-0.851,-0.01) 2(0.75,-0.005)
Pad_e859
  round 4 hole 3: 1(0,0)
Pad_e860
  round 4 hole 3: 1(0,0)
Pad_e861
  round 4 hole 3: 1(0,0)
Pad_e862
  round 4 hole 3: 1(0,0)
R0603
  rect 0.806x0.864 smd: 1(-0.753,0) 2(0.753,0)
RES-ADJ-TH_3296W
  round 1.524 hole 0.762: 1(0,2.54) 2(0,0) 3(0,-2.54)
RES-TH_RK09K1130AAU
  round 1.7 hole 1.1: 1(-2.5,-3.5) 2(0,-3.5) 3(2.5,-3.5)
  oval 3x3.3 hole 2x2.3: 4(5,3.5) 5(-5,3.5)
SOD-323_L1.8-W1.3-LS2.5-RD
  rect 1x0.75 smd: 1(-1.173,0) 2(1.173,0)
SOD-523_L1.2-W0.8-LS1.6-BI
  rect 0.6x0.4 smd: 1(-0.75,0) 2(0.75,0)
SOIC-14_L8.7-W3.9-P1.27-LS6.0-BL
  oval 0.574x2.038 smd: 1(-3.81,-2.769) 2(-2.54,-2.769) 3(-1.27,-2.769) 4(0,-2.769) 5(1.27,-2.769) 6(2.54,-2.769) 7(3.81,-2.769) 8(3.81,2.769) 9(2.54,2.769) 10(1.27,2.769) 11(0,2.769) 12(-1.27,2.769) 13(-2.54,2.769) 14(-3.81,2.769)
SOIC-16_L9.9-W3.9-P1.27-LS6.0-BL-1
  oval 0.6x1.8 smd: 1(-4.445,-2.972) 2(-3.175,-2.972) 3(-1.905,-2.972) 4(-0.635,-2.972) 5(0.635,-2.972) 6(1.905,-2.972) 7(3.175,-2.972) 8(4.445,-2.972) 9(4.445,2.972) 10(3.175,2.972) 11(1.905,2.972) 12(0.635,2.972) 13(-0.635,2.972) 14(-1.905,2.972) 15(-3.175,2.972) 16(-4.445,2.972)
SOP-8_L5.0-W4.0-P1.27-LS6.0-BL
  oval 0.574x2.035 smd: 1(-1.905,-2.768) 2(-0.635,-2.768) 3(0.635,-2.768) 4(1.905,-2.768) 5(1.905,2.768) 6(0.635,2.768) 7(-0.635,2.768) 8(-1.905,2.768)
SOP-16_L9.9-W3.9-P1.27-LS6.0-BL
  oval 0.574x2.038 smd: 1(-4.445,-2.769) 2(-3.175,-2.769) 3(-1.905,-2.769) 4(-0.635,-2.769) 5(0.635,-2.769) 6(1.905,-2.769) 7(3.175,-2.769) 8(4.445,-2.769) 9(4.445,2.769) 10(3.175,2.769) 11(1.905,2.769) 12(0.635,2.769) 13(-0.635,2.769) 14(-1.905,2.769) 15(-3.175,2.769) 16(-4.445,2.769)
SOP-16_L10.0-W3.9-P1.27-LS6.0-BL
  oval 0.56x1.745 smd: 1(-4.445,-2.873) 2(-3.175,-2.873) 3(-1.905,-2.873) 4(-0.635,-2.873) 5(0.635,-2.873) 6(1.905,-2.873) 7(3.175,-2.873) 8(4.445,-2.873) 9(4.445,2.873) 10(3.175,2.873) 11(1.905,2.873) 12(0.635,2.873) 13(-0.635,2.873) 14(-1.905,2.873) 15(-3.175,2.873) 16(-4.445,2.873)
SOP-24_L15.2-W7.5-P1.27-LS10.3-BL
  rect 0.569x2.119 smd: 1(-6.985,-4.609) 2(-5.715,-4.609) 3(-4.445,-4.609) 4(-3.175,-4.609) 5(-1.905,-4.609) 6(-0.635,-4.609) 7(0.635,-4.609) 8(1.905,-4.609) 9(3.175,-4.609) 10(4.445,-4.609) 11(5.715,-4.609) 12(6.985,-4.609) 13(6.985,4.609) 14(5.715,4.609) 15(4.445,4.609) 16(3.175,4.609) 17(1.905,4.609) 18(0.635,4.609) 19(-0.635,4.609) 20(-1.905,4.609) 21(-3.175,4.609) 22(-4.445,4.609) 23(-5.715,4.609) 24(-6.985,4.609)
SW-SMD_4P-L5.1-W5.1-P3.70-LS6.5-TL-2
  rect 1.7x1 smd: 1(-3.3,1.85) 2(3.3,1.85) 3(-3.3,-1.85) 4(3.3,-1.85)
SW-SMD_6P-L5.4-W5.4-P1.27-LS8.4
  rect 0.762x1.524 smd: 1(-1.27,-3.81) 2(0,-3.81) 3(1.27,-3.81) 4(1.27,3.81) 5(0,3.81) 6(-1.27,3.81)
SW-SMD_8P-L6.7-W5.4-P1.27-LS8.4
  rect 0.762x1.524 smd: 1(-1.905,-3.81) 2(-0.635,-3.81) 3(0.635,-3.81) 4(1.905,-3.81) 5(1.905,3.81) 6(0.635,3.81) 7(-0.635,3.81) 8(-1.905,3.81)
SW-SMD_16P-L11.7-W5.4-P1.27-LS8.5_1
  rect 0.76x1.6 smd: 1(-4.445,-3.815) 2(-3.175,-3.815) 3(-1.905,-3.815) 4(-0.635,-3.815) 5(0.635,-3.815) 6(1.905,-3.815) 7(3.175,-3.815) 8(4.445,-3.815) 9(4.445,3.815) 10(3.175,3.815) 11(1.905,3.815) 12(0.635,3.815) 13(-0.635,3.815) 14(-1.905,3.815) 15(-3.175,3.815) 16(-4.445,3.815)
SW-SMD_SS-3235S-L3.00
  rect 0.8x1.35 smd: 1(-2.54,3.25) 2(0,3.25) 3(2.54,3.25) 4(-2.54,-3.25) 5(0,-3.25) 6(2.54,-3.25)
TSSOP-20_L6.5-W4.4-P0.65-LS6.4-BL
  oval 0.364x1.742 smd: 1(-2.925,-2.871) 2(-2.275,-2.871) 3(-1.625,-2.871) 4(-0.975,-2.871) 5(-0.325,-2.871) 6(0.325,-2.871) 7(0.975,-2.871) 8(1.625,-2.871) 9(2.275,-2.871) 10(2.925,-2.871) 11(2.925,2.871) 12(2.275,2.871) 13(1.625,2.871) 14(0.975,2.871) 15(0.325,2.871) 16(-0.325,2.871) 17(-0.975,2.871) 18(-1.625,2.871) 19(-2.275,2.871) 20(-2.925,2.871)
USB-C-SMD_KH-TYPE-C-16P
  oval 1x2 hole 0.62x1.7: 1(-4.32,1.765) 2(4.32,1.765)
  oval 1x1.8 hole 0.62x1.4: 3(-4.32,-2.415) 4(4.32,-2.415)
  rect 0.3x1.3 smd: A5(-1.25,2.415) A6(-0.25,2.415) A7(0.25,2.415) A8(1.25,2.415) B5(1.75,2.415) B6(0.75,2.415) B7(-0.75,2.415) B8(-1.75,2.415)
  custom 0.6x1.3 smd: A9(-2.4,2.415) B2(3.2,2.415) B13(-3.2,2.415) B18(2.4,2.415)

## Nets
As in the schematic, except:
GND: C1.2 C2.2 C3.2 C4.2 C5.2 C6.2 C7.2 C8.2 C9.2 C10.2 C11.2 C12.2 C13.2 C14.1 C15.2 C16.2 C20.2 C21.2 C24.1 C25.2 C26.2 C27.1 C28.2 C29.2 D129.2 H5.8 H6.2 LED25.1 LED26.1 LED27.1 LED28.1 LED29.1 LED30.1 LED31.1 LED32.1 LED33.1 LED34.1 LED35.1 LED36.1 LED37.1 LED38.1 LED40.1 LED42.1 R9.1 R10.1 R11.1 R12.1 R13.1 R14.1 R15.1 R16.1 SW1.3 SW1.6 SW3.3 SW3.4 SW4.3 SW4.4 U16.1 U16.10 U16.19 U17.12 U17.18 U17.19 U18.7 U19.7 U19.8 U19.10 U20.7 U20.8 U20.10 U21.7 U21.8 U21.10 U22.8 U23.1 U23.3 U23.8 U23.13 U23.15 U24.1 U24.3 U24.8 U24.13 U24.15 U25.7 U25.8 U26.7 U27.7 U28.7 U32.1 U34.8 USB2.B2 USB2.B13
VCC: SW5.1 SW5.4 USB2.A9 USB2.B18

Pads without a net: LED39 5; NOREF 1; NOREF#2 1; NOREF#3 1; NOREF#4 1; R73 4 5; U19 15; U20 15; U21 15; U22 15; U26 8 9 10 11 12 13; USB2 1 2 3 4 A5 A6 A7 A8 B5 B6 B7 B8

## Via types
v1: diameter 0.51, hole 0.305, Top Layer to Bottom Layer, 903 vias
v2: diameter 1.016, hole 0.508, Top Layer to Bottom Layer, 2 vias

## Routing (per net, layer and track width the routed paths; a pad name or vN(x,y) marks a point on that pad's centre or on a via; arc(x,y) is an arc through that point)
+5V: length 160.2
  Top Layer w0.203: v1(11.81,7.04) R48.2 ; U32.8 v1(6.73,56.44) ; 8.71,92.63 10.16,92.63 10.41,92.89 10.41,94.28 10.16,94.54 C15.1 v1(9.21,95.81) ; v1(11.43,51.74) 11.43,52.25 11.68,52.49 R76.1 ; R41.2 10.67,62.03 v1(10.16,61.52) ; v1(1.12,87.55) 2.82,87.55 ; v1(89.79,10.97) 90.68,10.97 90.99,10.66 C26.1 ; D129.1 v1(9.78,7.04) ; v1(1.12,88.82) 2.82,88.82
  Top Layer w0.254: LED10.2 v1(80.9,91.73) ; U32.4 v1(10.54,54.53) ; v1(85.6,34.59) 85.09,34.59 84.84,34.34 R3.2 ; U19.16 v1(50.41,33.07) C3.1 ; v1(88.65,34.59) 88.14,34.59 87.88,34.34 R5.2 ; v1(2.92,59.81) 1.52,59.81 1.4,59.68 ; C9.1 v1(62.99,9.96) U25.16 ; LED18.2 v1(80.77,60.49) ; U28.3 v1(67.03,30.53) ; v1(14.73,30.78) 15.37,30.15 U29.8 ; 77.67,9.96 v1(76.14,9.96) U26.14 ; R1.2 81.79,34.34 82.04,34.59 v1(82.55,34.59) ; R6.2 89.41,34.34 89.66,34.59 v1(90.17,34.59) ; U29.6 17.91,30.15 v1(17.27,30.78) ; U24.16 v1(63.12,21.77) C8.1 ; LED9.2 v1(65.28,91.73) ; C14.2 v1(26.61,72.82) ; v1(87.12,34.59) 86.61,34.59 86.36,34.34 R4.2 ; U29.7 16.64,30.15 v1(16,30.78) ; U18.14 23.24,64.19 23.75,63.68 24.89,63.68 25.49,64.27 C16.1 26.67,64.22 v1(26.67,63.04) ; v1(90.42,22.66) 91.63,22.66 91.63,23.61 91.19,24.05 89.66,24.05 89.28,23.68 89.28,22.45 ; LED15.2 v1(96.52,76.11) ; LED11.2 v1(96.52,91.73) ; U27.14 v1(76.07,21.77) C11.1 ; C5.1 v1(50.12,21.77) U20.16 ; v1(18.8,30.78) 19.18,30.4 U29.5 ; LED23.2 v1(96.65,44.49) ; R7.2 90.93,34.34 91.19,34.59 v1(91.69,34.59) ; C4.1 v1(36.51,9.96) 34.85,9.96 ; C7.1 v1(63.13,33.07) U23.16 ; U17.24 38.61,29.77 39.37,30.53 C1.1 v1(40.46,31.74) ; v1(96.52,60.5) 96.51,60.49 LED19.2 ; R2.2 83.31,34.34 83.57,34.59 v1(84.07,34.59) ; LED8.2 v1(49.66,91.73) ; LED39.3 v1(23.5,78.16) ; U28.14 v1(76.55,33.07) C12.1 ; 96.22,10.33 v1(95.03,10.33) ; LED20.2 v1(49.66,44.49) ; C6.1 v1(50.23,9.96) U21.16 ; LED39.8 23.5,96.19 22.99,96.7 14.22,96.7 13.78,96.25 13.78,94.92 ; U28.4 v1(67.03,29.26) ; LED21.2 v1(65.15,44.49) ; R8.2 92.46,34.34 92.71,34.59 v1(93.22,34.59) ; C13.1 v1(14.92,94.54) ; U26.4 v1(67.03,6.15) ; LED12.2 v1(49.66,76.11) ; R38.1 v1(26.6,60.63) ; LED17.2 v1(65.15,60.49) ; v1(3.05,82.86) SW1.1 3.05,75.16 3.3,74.91 ; U28.11 v1(75.95,29.26) ; 34.85,2.34 v1(36.45,2.34) ; LED14.2 v1(80.77,76.11) ; LED13.2 v1(65.15,76.11) ; U22.7 v1(26.8,2.34) ; LED16.2 v1(49.66,60.49) ; LED22.2 v1(80.77,44.49) ; R33.2 v1(11.05,75.62)
  Inner1 w0.381: v1(33.91,14.53) v1(27.18,14.53)
  vias: v1(16.26,16.18) v1(16.26,13.88) v1(18.16,12.37) v1(18.16,11.2) v1(18.67,9.32) v1(18.67,7.93) v1(18.67,6.66) v1(19.43,9.32) v1(19.43,7.93) v1(19.43,6.66) v1(20.07,16.18) v1(20.07,13.88) v1(21.59,6.15) v1(23.24,7.54) v1(24.77,6.15)
GND: length 126.2
  Top Layer w0.203: v1(80.76,5.5) 82.08,5.5 ; v1(26.03,35.74) 26.03,34.85 25.78,34.6 24.71,34.6 ; 17.98,34.6 v1(19.3,34.6) ; SW4.4 v1(17.98,42.72) ; D129.2 v1(9.78,3.23) ; C26.2 v1(93.73,9.96) ; v1(89.9,5.5) 91.22,5.5 ; U32.1 v1(6.73,54.53)
  Top Layer w0.254: v1(2.92,56.19) C29.2 1.4,56.22 1.4,58.28 ; U24.13 v1(63.13,17.96) ; U21.7 v1(41.06,2.34) ; v1(6.1,32.44) 5.46,33.07 LED38.1 ; C5.2 v1(54.23,21.77) U24.1 ; 61.42,31.8 v1(63.13,31.8) ; C1.2 39.43,33.19 v1(40.46,33.19) ; v1(88.65,24.05) 88.65,22.46 U16.19 ; C3.2 v1(54.22,33.07) U23.1 ; C4.2 39.5,10.02 39.5,10.72 40,11.23 v1(40.51,11.23) ; U20.10 v1(50.13,14.15) ; U23.3 v1(54.23,30.53) ; U24.3 v1(54.23,19.23) ; LED42.1 7.62,5.74 v1(7.62,7.04) ; LED40.1 v1(26.55,67.87) ; U23.13 v1(63.13,29.26) ; SW3.4 v1(24.71,42.72) ; U20.8 v1(41.04,12.88) ; LED29.1 v1(94.64,30.01) ; LED30.1 v1(94.65,23.66) ; U21.10 v1(50.23,2.34) ; v1(92.71,24.31) 93.03,23.99 93.03,22.66 ; v1(6.6,94.54) 7.87,94.54 ; LED36.1 9.25,33.07 v1(9.88,32.44) ; C6.2 v1(52.77,8.69) ; LED34.1 5.46,21.51 v1(6.1,20.88) ; 4.7,58.28 4.63,58.34 v1(2.92,58.34) ; U17.18 v1(34.29,22.15) ; U25.8 v1(54.07,1.07) ; SW1.3 v1(8.13,82.86) ; U28.7 v1(67.03,25.45) ; v1(11.18,94.54) C13.2 ; C8.2 v1(65.72,20.5) ; U20.7 v1(41.06,14.15) ; C7.2 65.72,31.93 ; 89.28,28.19 v1(89.28,26.87) ; 36.23,23.42 v1(34.29,23.42) ; 7.36,33.75 7.36,33.07 v1(7.99,32.44) ; LED33.1 7.37,22.48 7.37,21.64 v1(8.13,20.88) ; C9.2 v1(66.8,9.96) ; U23.8 v1(54.23,24.18) ; U24.15 v1(63.12,20.5) ; U25.7 v1(54.07,2.34) ; 2.97,83.87 2.84,83.74 v1(1.14,83.74) ; U16.10 v1(83.44,26.34) ; U24.8 v1(54.23,12.88) ; C11.2 v1(80.14,21.77) ; C16.2 28.07,64.32 v1(28.07,65.46) ; C20.2 v1(2.79,63.17) ; v1(41.06,1.07) U21.8 ; U19.8 v1(41.18,24.18) ; C14.1 v1(28,72.82) ; U26.7 v1(67.03,2.34) ; C12.2 v1(79.06,31.67) ; 24.71,34.6 v1(23.11,34.6) ; LED31.1 11.14,21.64 v1(11.9,20.88) ; C21.2 v1(10.8,70.12) ; LED35.1 11.14,33.07 v1(11.78,32.44) ; v1(10.01,20.88) 9.25,21.64 LED32.1 ; U27.7 v1(67.03,14.15) ; 86.65,5.5 v1(85.33,5.5) ; 77.51,5.5 v1(76.18,5.5) ; U19.7 v1(41.18,25.45) ; U22.8 v1(26.8,1.07) ; U19.10 50.04,25.45 ; U18.7 v1(15.62,72.95)
  Top Layer w0.508: 7.88,16.46 9.17,16.46 v2(10.29,17.58) ; 7.88,10.06 9.17,10.06 v2(10.29,8.94)
  Inner2 w0.254: v1(49.4,38.08) v1(49.4,36.63)
  vias: v1(0.75,82.45) v1(0.75,81.2) v1(0.75,67.08) v1(0.75,65.84) v1(1.14,90.09) v1(2.03,82.45) v1(2.03,81.2) v1(2.02,79.41) v1(2.02,77.15) v1(2.03,67.08) v1(2.03,65.84) v1(2.53,14.61) v1(2.53,13.36) v1(2.53,12.12) v1(3.81,14.61) v1(3.81,13.36) v1(3.81,12.12) v1(3.93,42.95) v1(3.93,41.71) v1(5.21,42.95) v1(5.21,41.71) v1(5.21,16.61) v1(5.33,9.91) v1(6.22,5.49) v1(6.22,4.24) v1(9.14,79.43) v1(9.53,14.23) v1(9.53,13.24) v1(9.53,12.24) v1(11.43,41.96) v1(12.06,59.11) v1(12.06,57.34) v1(12.06,56.06) v1(12.06,44.98) v1(12.06,43.74) v1(12.06,8.94) v1(12.71,41.96) v1(13.08,31.27) v1(13.08,30.02) v1(13.33,44.98) v1(13.33,43.74) v1(13.31,8.94) v1(13.33,5.51) v1(13.33,4.27) v1(13.46,69.52) v1(13.58,21.25) v1(13.58,20) v1(13.72,60.64) v1(13.72,59.36) v1(14.49,69.52) v1(14.48,66.73) v1(14.48,65.46) v1(14.73,3.99) v1(14.73,2.59) v1(14.73,1.11) v1(15.24,90.09) v1(15.24,88.06) v1(15.24,85.78) v1(15.24,82.22) v1(15.24,80.31) v1(15.74,3.99) v1(15.74,1.11) v1(16.52,90.09) v1(16.51,88.06) v1(16.51,85.78) v1(16.51,82.22) v1(16.89,94.79) v1(18.16,44.12) v1(18.54,69.14) v1(18.79,49.05) v1(18.79,47.8) v1(18.8,3.99) v1(18.8,1.07) v1(19.3,83.11) v1(19.44,44.12) v1(19.56,42.72) v1(19.82,69.14) v1(19.94,90.22) v1(20.07,49.05) v1(20.07,47.8) v1(20.19,3.99) v1(20.19,1.07) v1(20.7,20.37) v1(20.7,19.1) v1(20.95,58.32) v1(21.59,3.99) v1(21.57,2.12) v1(21.59,1.07) v1(21.72,27.33) v1(21.72,26.09) v1(21.72,24.41) v1(21.72,23.16) v1(21.74,11.81) v1(21.74,10.57) v1(21.74,9.32) v1(21.95,20.37) v1(21.95,19.1) v1(22.22,58.32) v1(23.02,11.81) v1(23.02,10.57) v1(23.02,9.32) v1(23.24,2.12) v1(23.24,1.07) v1(24.75,4.01) v1(24.75,2.12) v1(24.75,1.07) v1(26.53,12.78) v1(26.53,11.53) v1(27.81,12.78) v1(27.81,11.53) v1(28.45,80.58) v1(28.45,79.3) v1(28.96,86.41) v1(30.48,93.14) v1(30.48,91.87) v1(30.61,88.19) v1(30.61,86.41) v1(31.73,93.14) v1(31.73,91.87) v1(34.16,98.87) v1(35.41,98.87) v1(38.23,2.34) v1(39.51,2.34) v1(41.78,11.48) v1(43.03,11.48) v1(44.96,2.59) v1(46.24,2.59) v1(47.12,98.87) v1(47.12,49.84) v1(47.12,48.56) v1(47.12,47.3) v1(47.37,81.21) v1(47.37,80.06) v1(47.37,78.92) v1(47.37,65.59) v1(47.37,64.44) v1(47.37,63.3) v1(48.36,98.87) v1(48.36,49.84) v1(48.36,48.56) v1(48.36,47.3) v1(48.39,11.48) v1(48.49,81.21) v1(48.49,80.06) v1(48.49,78.92) v1(48.49,65.59) v1(48.49,64.44) v1(48.49,63.3) v1(49.61,98.87) v1(49.61,81.21) v1(49.61,80.06) v1(49.61,78.92) v1(49.61,65.59) v1(49.61,64.44) v1(49.61,63.3) v1(49.61,49.84) v1(49.61,48.56) v1(49.61,47.3) v1(49.63,11.48) v1(50.15,25.45) v1(51.56,2.34) v1(52.84,2.34) v1(54.07,8.69) v1(54.07,7.44) v1(62.74,81.47) v1(62.74,80.19) v1(62.74,78.92) v1(62.74,49.84) v1(62.74,48.56) v1(62.74,47.3) v1(62.87,98.99) v1(62.87,65.85) v1(62.87,64.57) v1(62.87,63.3) v1(63.5,27.99) v1(63.5,26.72) v1(63.63,15.04) v1(63.98,81.47) v1(63.98,80.19) v1(63.98,78.92) v1(63.98,49.84) v1(63.98,48.56) v1(63.98,47.3) v1(64.11,98.99) v1(64.11,65.85) v1(64.11,64.57) v1(64.11,63.3) v1(64.26,4.37) v1(65.23,81.47) v1(65.23,80.19) v1(65.23,78.92) v1(65.23,49.84) v1(65.23,48.56) v1(65.23,47.3) v1(65.25,27.99) v1(65.25,26.72) v1(65.36,98.99) v1(65.36,65.85) v1(65.36,64.57) v1(65.36,63.3) v1(65.72,31.87) v1(65.66,24.18) v1(65.91,18.06) v1(65.91,16.81) v1(66.04,7.43) v1(66.04,6.15) v1(66.04,4.89) v1(66.04,3.61) v1(69.6,34.34) v1(70.65,30.69) v1(70.65,29.45) v1(70.84,34.34) v1(72.14,34.34) v1(73.38,34.34) v1(78.23,81.72) v1(78.23,80.44) v1(78.23,79.17) v1(78.3,66.18) v1(78.3,64.9) v1(78.3,63.63) v1(78.36,98.99) v1(78.36,50.35) v1(78.36,49.07) v1(78.36,47.8) v1(79.48,81.72) v1(79.48,80.44) v1(79.48,79.17) v1(79.55,66.18) v1(79.55,64.9) v1(79.55,63.63) v1(79.6,98.99) v1(79.6,50.35) v1(79.6,49.07) v1(79.6,47.8) v1(79.63,29.77) v1(79.63,28.5) v1(79.88,25.58) v1(80.72,81.72) v1(80.72,80.44) v1(80.72,79.17) v1(80.79,66.18) v1(80.79,64.9) v1(80.79,63.63) v1(80.85,98.99) v1(80.85,50.35) v1(80.85,49.07) v1(80.85,47.8) v1(80.88,29.77) v1(80.88,28.5) v1(80.86,16.71) v1(80.9,13.26) v1(83.3,16.71) v1(83.33,13.26) v1(85.73,16.71) v1(85.75,13.26) v1(88.16,16.71) v1(88.18,13.26) v1(88.9,3.99) v1(90.15,3.99) v1(90.59,16.71) v1(90.61,13.26) v1(92.99,16.71) v1(93.02,13.26) v1(93.73,2.95) v1(93.73,1.7) v1(95.4,81.85) v1(95.4,80.57) v1(95.4,79.3) v1(95.4,65.85) v1(95.4,64.57) v1(95.4,63.3) v1(95.4,50.22) v1(95.4,48.95) v1(95.4,47.68) v1(96.65,81.85) v1(96.65,80.57) v1(96.65,79.3) v1(96.65,65.85) v1(96.65,64.57) v1(96.65,63.3) v1(96.65,50.22) v1(96.65,48.95) v1(96.65,47.68) v1(97.89,81.85) v1(97.89,80.57) v1(97.89,79.3) v1(97.89,65.85) v1(97.89,64.57) v1(97.89,63.3) v1(97.89,50.22) v1(97.89,48.95) v1(97.89,47.68) v1(98.81,15.9) v1(98.81,14.66)
VCC: length 19.7
  Top Layer w0.508: 14.35,15.66 SW5.1 ; 14.35,15.66 SW5.4 ; 14.35,15.66 7.88,15.66 ; 7.88,10.86 14.19,10.86 14.48,11.15
A0: length 11.9
  Top Layer w0.203: U19.14 50.04,30.53 ; U23.6 v1(54.23,26.72)
  Bottom Layer w0.203: 50.04,30.53 49.4,30.53 49.02,30.15 49.02,29.01 49.4,28.63 51.56,28.63 52.07,28.12 52.07,27.23 52.58,26.72 v1(54.23,26.72)
  vias: v1(50.15,30.53)
A1: length 18.8
  Top Layer w0.203: U23.10 v1(63.13,25.45) ; U19.13 50.04,29.26
  Bottom Layer w0.203: 50.04,29.26 51.69,29.26 52.32,28.63 56.77,28.63 57.28,28.12 57.28,25.96 57.78,25.45 62.87,25.45
  vias: v1(50.15,29.26)
A2: length 18.4
  Top Layer w0.203: U19.12 50.29,27.99 51.05,27.23 v1(51.05,25.04) ; U24.6 v1(54.23,15.42)
  Bottom Layer w0.203: v1(54.23,15.42) 52.45,15.42 51.94,15.93 51.94,17.83 51.56,18.21 51.56,24.53 v1(51.05,25.04)
A3: length 26.9
  Top Layer w0.203: U19.11 50.04,26.72 ; U24.10 v1(63.13,14.15)
  Bottom Layer w0.203: 50.04,26.72 51.18,26.72 51.94,25.96 52.58,25.96 53.21,25.32 53.21,23.93 54.48,22.66 58.42,22.66 59.18,21.9 59.18,17.96 58.42,17.2 58.42,15.42 59.69,14.15 62.87,14.15
  vias: v1(50.15,26.72)
ADD0: length 72.1
  Top Layer w0.203: U25.4 v1(54.07,6.15) ; U19.3 v1(41.18,30.53) 40.51,30.53 37.97,27.99 v1(37.97,19.23) 37.97,13.39 37.59,13 31.62,13 30.61,11.99 30.61,7.93 30.1,7.42 U22.3 v1(26.8,7.42) ; U20.3 v1(41.06,19.23) ; U21.3 v1(41.06,7.42)
  Bottom Layer w0.203: v1(26.8,7.42) v1(41.06,7.42) 51.05,7.42 52.32,6.15 v1(54.07,6.15) ; v1(37.97,19.23) v1(41.06,19.23)
ADD1: length 79.2
  Top Layer w0.203: U20.4 v1(41.06,17.96) ; U25.1 v1(54.07,9.96) ; v1(26.8,6.15) U22.4 30.99,6.15 31.5,6.66 31.5,11.74 32.13,12.37 38.1,12.37 38.61,12.88 v1(38.61,17.96) 38.61,27.48 40.39,29.26 v1(41.18,29.26) U19.4 ; U21.4 v1(41.06,6.15)
  Bottom Layer w0.203: v1(54.07,9.96) 55.37,9.96 55.88,9.45 55.88,6.02 55.37,5.51 51.31,5.51 50.67,6.15 v1(41.06,6.15) v1(26.8,6.15) ; v1(38.61,17.96) v1(41.06,17.96)
ADD2: length 81.2
  Top Layer w0.203: v1(26.8,4.88) U22.5 31.75,4.88 32.26,5.38 32.26,11.1 32.89,11.74 38.61,11.74 39.24,12.37 v1(39.24,16.69) 39.24,26.97 40.26,27.99 v1(41.18,27.99) U19.5 ; U25.13 63.02,6.15 ; U20.5 v1(41.06,16.69) ; U21.5 v1(41.06,4.88)
  Bottom Layer w0.203: v1(39.24,16.69) v1(41.06,16.69) ; v1(26.8,4.88) v1(41.06,4.88) 50.42,4.88 51.05,4.24 57.53,4.24 59.44,6.15 63.02,6.15
  vias: v1(62.99,6.15)
ADD3: length 80.4
  Top Layer w0.203: U19.6 v1(41.18,26.72) 40.13,26.72 39.88,26.47 v1(39.88,15.42) 39.88,12.12 38.86,11.1 33.53,11.1 33.02,10.59 33.02,4.12 32.51,3.61 U22.6 v1(26.8,3.61) ; U21.6 v1(41.06,3.61) ; U25.10 v1(63.02,2.34) ; U20.6 v1(41.06,15.42)
  Bottom Layer w0.203: v1(63.02,2.34) 59.69,2.34 59.06,2.97 51.05,2.97 50.42,3.61 v1(41.06,3.61) v1(26.8,3.61) ; v1(39.88,15.42) v1(41.06,15.42)
B0: length 15.3
  Top Layer w0.203: v1(52.96,23.04) 52.96,27.48 53.47,27.99 v1(54.23,27.99) U23.5 ; U20.14 v1(52.42,19.23)
  Bottom Layer w0.203: v1(52.96,23.04) 52.96,19.76 v1(52.42,19.23)
B1: length 20.6
  Top Layer w0.203: v1(57.78,21.01) 57.78,26.47 58.04,26.72 U23.11 ; U20.13 v1(52.93,17.96)
  Bottom Layer w0.203: v1(52.93,17.96) 53.34,18.37 53.34,19.35 53.9,19.92 57.2,19.92 57.78,20.5 v1(57.78,21.01)
B2: length 7.1
  Top Layer w0.203: U20.12 v1(54.23,16.69) U24.5
B3: length 13.4
  Top Layer w0.203: v1(58.27,14.78) 58.91,15.42 U24.11 ; U20.11 51.05,15.42 51.67,14.8 v1(53.34,14.8)
  Bottom Layer w0.203: v1(58.27,14.78) 58.25,14.8 v1(53.34,14.8)
CLK: length 255.6
  Top Layer w0.254: U20.2 v1(41.02,20.5) ; 42.62,31.8 v1(41.15,31.8) ; U21.2 v1(41.02,8.69) ; v1(67.06,7.42) U26.3 ; v1(26.8,8.69) U22.2 ; U18.5 v1(18.16,72.95)
  Inner1 w0.254: 9.14,78 13.74,78 14.99,76.75 17.28,76.75 18.16,75.87 v1(18.16,72.95) ; 9.14,78 9.14,72.19 8,71.04 8,60.38 7.37,59.74 7.37,46.28 ; 9.14,78 7.24,79.91 7.24,91.87 8.38,93.02 17.65,93.02 18.67,94.03 H5.6 ; 7.37,46.28 6.22,45.14 H2.2 ; 7.37,46.28 18.92,46.28 25.15,40.06 ; v1(67.06,7.42) 67.94,7.42 68.71,8.18 68.71,34.98 66.42,37.26 42.29,37.26 ; v1(41.15,31.8) 41.69,31.8 42.29,32.41 ; 43.31,21.01 43.31,31.39 42.29,32.41 ; 43.31,21.01 42.8,20.5 v1(41.02,20.5) ; 43.31,21.01 44.07,20.24 44.07,9.96 42.8,8.69 v1(41.02,8.69) ; 42.29,37.26 42.29,32.41 ; 42.29,37.26 39.5,40.06 25.15,40.06 ; v1(26.8,8.69) 25.78,8.69 25.15,9.32 25.15,40.06
DATA0: length 27.4
  Top Layer w0.203: v1(57.02,13.51) 57.02,25.07 56.64,25.45 U23.7 v1(54.23,25.45) ; 54.1,4.88 U25.5
  Bottom Layer w0.203: 54.1,4.88 56.39,4.88 57.02,5.51 v1(57.02,13.51)
  vias: v1(54.07,4.88)
DATA1: length 25.2
  Top Layer w0.203: v1(57.66,7.42) U25.3 ; v1(58.04,13.53) 57.66,13.91 57.66,15.93 58.17,16.43 v1(59.82,16.43) ; U23.9 v1(63.12,24.18)
  Bottom Layer w0.203: v1(58.04,13.53) 58.04,7.8 v1(57.66,7.42) ; v1(63.12,24.18) 62.36,24.18 61.85,23.67 61.85,16.94 61.34,16.43 v1(59.82,16.43)
DATA2: length 17.8
  Top Layer w0.203: U24.7 v1(54.23,14.15) ; v1(62.99,7.42) U25.14
  Bottom Layer w0.203: v1(62.99,7.42) 60.07,7.42 59.26,8.23 59.26,13.56 58.67,14.15 v1(54.23,14.15)
DATA3: length 13.6
  Top Layer w0.203: U24.9 v1(63.07,12.88) ; v1(62.99,4.88) U25.12
  Bottom Layer w0.203: v1(62.99,4.88) 63.88,4.88 64.52,5.51 64.52,12.24 63.88,12.88 v1(63.07,12.88)
IN0: length 84.9
  Top Layer w0.203: v1(37.73,30.78) v1(19.69,30.78) ; U23.4 v1(54.23,29.26) ; U29.4 v1(19.18,27.36) ; v1(11.18,28.75) 11.18,27.72 R56.1
  Top Layer w0.254: 19.18,21.26 19.18,20.62 v1(19.81,19.99)
  Bottom Layer w0.203: H1.4 2.03,30.28 2.41,30.66 2.92,30.66 3.68,31.42 10.67,31.42 11.18,30.91 v1(11.18,28.75) ; v1(54.23,29.26) 53.21,29.26 52.71,29.77 52.71,33.45 52.2,33.96 50.26,33.96 49.78,33.49 49.78,32.94 45.47,28.63 39.88,28.63 v1(37.73,30.78) ; v1(19.18,27.36) 19.18,30.28 v1(19.69,30.78)
  Bottom Layer w0.254: v1(11.18,28.75) 11.18,26.09 12.06,25.2 18.29,25.2 19.81,23.67 v1(19.81,19.99)
IN1: length 93.9
  Top Layer w0.203: v1(9.27,28.75) 9.27,27.71 R57.1 ; v1(19.69,31.55) v1(37.72,31.55) ; v1(57.28,31.29) 57.28,28.5 57.78,27.99 U23.12 ; U29.3 v1(17.91,27.36)
  Top Layer w0.254: v1(18.54,19.99) 17.91,20.62 U29.3
  Bottom Layer w0.203: v1(37.72,31.55) 38.35,31.55 39.88,30.02 45.85,30.02 49.15,33.33 49.15,33.93 49.81,34.59 56.39,34.59 57.28,33.71 v1(57.28,31.29) ; v1(17.91,27.36) 17.91,30.78 18.67,31.55 v1(19.69,31.55) ; 1.65,26.47 H1.3 3.3,27.74 3.3,30.15 3.81,30.66 8.76,30.66 9.27,30.15 v1(9.27,28.75)
  Bottom Layer w0.254: v1(18.54,19.99) 18.54,22.78 17.27,24.05 10.03,24.05 9.27,24.82 v1(9.27,28.75)
IN2: length 109.1
  Top Layer w0.203: U24.4 v1(54.23,17.96) ; v1(58.55,21) 58.55,26.07 v1(58.53,26.09) ; v1(37.72,32.31) 37.7,32.29 v1(19.69,32.29) ; U29.2 v1(16.64,27.36) ; R58.1 7.37,27.69 v1(7.37,28.75)
  Top Layer w0.254: U29.2 16.64,20.62 v1(17.27,19.99)
  Bottom Layer w0.203: v1(19.69,32.29) 17.76,32.29 16.64,31.17 v1(16.64,27.36) ; v1(7.37,28.75) 7.37,29.51 6.98,29.9 4.44,29.9 4.06,29.51 4.06,24.31 3.68,23.93 1.65,23.93 ; v1(58.55,21) 58.55,18.47 58.04,17.96 v1(54.23,17.96) ; v1(58.53,26.09) 58.53,33.85 57.15,35.23 49.66,35.23 48.51,34.09 48.51,33.58 46.1,31.17 39.88,31.17 38.73,32.31 v1(37.72,32.31)
  Bottom Layer w0.254: v1(17.27,19.99) 17.27,22.15 16.38,23.04 8.25,23.04 7.37,23.93 v1(7.37,28.75)
IN3: length 110
  Top Layer w0.203: v1(16,19.99) 15.37,20.62 U29.1 v1(15.37,27.36) ; v1(5.46,28.75) 5.46,27.68 R59.1 ; v1(63.12,16.69) U24.12 ; v1(59.82,21.01) 59.82,22.78 59.28,23.32 v1(59.28,26.09) ; v1(19.69,33.07) v1(37.72,33.07)
  Bottom Layer w0.203: v1(5.46,28.75) 5.46,22.4 5.33,22.28 5.46,22.28 ; 5.46,22.28 4.57,21.39 1.65,21.39 ; 5.46,22.28 15.24,22.28 16,21.51 v1(16,19.99) ; v1(59.28,26.09) 59.28,34.37 57.78,35.86 49.02,35.86 47.88,34.72 47.88,33.83 46.48,32.44 39.75,32.44 39.12,33.07 v1(37.72,33.07) ; v1(63.12,16.69) 63.12,15.8 62.48,15.16 59.69,15.16 59.06,15.8 59.06,16.81 59.82,17.58 v1(59.82,21.01) ; v1(15.37,27.36) 15.37,31.93 16.51,33.07 v1(19.69,33.07)
IROM0: length 86.5
  Top Layer w0.203: D3.1 38.16,83.5 38.15,83.49 ; D4.1 41.49,83.5 41.47,83.49 ; R17.1 48.48,83.84 48.13,83.49 46.51,83.49 ; 46.51,83.49 44.82,83.49 ; 46.51,83.49 46.51,83.49 D8.1 ; 39.81,83.49 38.15,83.49 ; 39.81,83.49 41.47,83.49 ; 39.81,83.49 39.82,83.51 D5.1 ; 38.15,83.49 36.48,83.49 ; 43.14,83.49 43.15,83.5 D7.1 ; 43.14,83.49 41.47,83.49 ; 43.14,83.49 44.82,83.49 ; v1(26.92,35.1) 26.92,55.42 29.59,58.09 29.59,72.31 30.23,72.95 30.23,82.73 30.99,83.49 34.8,83.49 ; 44.82,83.49 44.82,84.27 D6.1 ; D2.1 36.49,83.5 36.48,83.49 ; 36.48,83.49 34.8,83.49 ; U17.1 v1(23.29,29.77) ; 34.8,83.49 34.8,84.24 D1.1
  Bottom Layer w0.203: v1(23.29,29.77) 23.29,33.75 24.13,34.59 26.42,34.59 v1(26.92,35.1)
IROM1: length 104
  Top Layer w0.203: D12.1 57.14,84.26 57.14,83.36 ; 53.79,83.36 55.47,83.36 ; 53.79,83.36 53.79,83.37 D10.1 ; 53.79,83.36 52.11,83.36 ; 55.47,83.36 57.14,83.36 ; 55.47,83.36 55.47,84.26 D13.1 ; 50.47,83.36 49.53,83.36 49.15,82.98 31.62,82.98 30.86,82.22 30.86,72.69 30.23,72.06 30.23,57.71 27.56,55.04 v1(27.56,34.47) ; 50.47,83.36 52.11,83.36 ; 50.47,83.36 50.45,83.38 D9.1 ; 57.14,83.36 58.82,83.36 ; 58.82,83.36 60.48,83.36 ; 58.82,83.36 58.82,84.25 D15.1 ; 52.11,83.36 52.12,83.37 D11.1 ; 60.48,83.36 60.47,83.38 D14.1 ; 60.48,83.36 62.13,83.36 ; 62.13,83.36 62.13,83.37 D16.1 ; 62.13,83.36 63.71,83.36 64.04,83.69 R18.1 ; U17.2 v1(23.29,28.5)
  Bottom Layer w0.203: v1(27.56,34.47) 27.18,34.09 24.38,34.09 23.94,33.64 23.94,29.15 v1(23.29,28.5)
IROM2: length 121.3
  Top Layer w0.203: v1(28.19,35.1) 28.19,54.66 30.86,57.33 30.86,71.81 31.5,72.44 31.5,81.71 32.26,82.47 49.91,82.47 50.16,82.73 64.52,82.73 65.06,83.27 65.94,83.27 ; D24.1 77.62,83.28 77.62,83.27 ; 77.62,83.27 76,83.27 ; 77.62,83.27 79.28,83.27 79.6,83.58 79.6,84.27 ; D21.1 72.64,84.25 72.64,83.27 ; 76,83.27 74.25,83.27 ; 76,83.27 75.96,83.31 D22.1 ; D20.1 70.96,84.26 70.96,83.27 ; U17.3 v1(23.29,27.23) ; D17.1 65.94,83.27 ; 65.94,83.27 67.58,83.27 ; 74.25,83.27 72.64,83.27 ; 74.25,83.27 74.29,83.3 D23.1 ; D19.1 67.61,83.3 67.58,83.27 ; 69.27,83.27 67.58,83.27 ; 69.27,83.27 70.96,83.27 ; 69.27,83.27 69.28,83.28 D18.1 ; 70.96,83.27 72.64,83.27
  Bottom Layer w0.203: v1(23.29,27.23) 24.13,27.23 24.57,27.67 24.57,33.13 24.89,33.45 27.43,33.45 28.19,34.21 v1(28.19,35.1)
IROM3: length 136.9
  Top Layer w0.203: 91.57,83.2 92.93,83.2 93.25,83.52 D32.1 95.1,84.27 95.22,84.39 ; 91.57,83.2 89.87,83.2 ; 91.57,83.2 91.58,83.21 D30.1 ; 86.58,83.2 88.22,83.2 ; 86.58,83.2 86.57,83.21 D29.1 ; 86.58,83.2 84.92,83.2 ; 88.22,83.2 89.87,83.2 ; 88.22,83.2 88.24,83.22 D28.1 ; 81.57,83.2 83.22,83.2 ; 81.57,83.2 80.35,83.2 79.76,82.6 65.91,82.6 65.41,82.09 51.05,82.09 50.8,81.84 32.89,81.84 32.13,81.08 32.13,72.19 31.5,71.55 31.5,57.07 28.83,54.41 v1(28.83,34.47) ; 81.57,83.2 D25.1 ; 83.22,83.2 84.92,83.2 ; 83.22,83.2 83.24,83.22 D27.1 ; 84.92,83.2 84.9,83.21 D26.1 ; 89.87,83.2 89.91,83.24 D31.1 ; U17.4 v1(23.29,25.96)
  Bottom Layer w0.203: v1(23.29,25.96) 24.64,25.96 25.15,26.47 25.15,32.31 25.65,32.82 27.56,32.82 28.83,34.09 v1(28.83,34.47)
IROM4: length 75.9
  Top Layer w0.203: D38.1 44.84,67.76 44.83,67.74 ; 38.18,67.74 38.18,68.55 D34.1 ; 38.18,67.74 36.48,67.74 ; 38.18,67.74 39.82,67.74 ; D36.1 41.52,68.55 41.52,67.74 ; 36.48,67.74 36.5,67.76 D35.1 ; 36.48,67.74 34.78,67.74 ; 39.82,67.74 39.84,67.76 D37.1 ; 39.82,67.74 41.52,67.74 ; 34.78,67.74 34.83,67.79 D33.1 ; 34.78,67.74 32.89,67.74 32.13,66.98 32.13,56.82 29.46,54.15 v1(29.46,35.1) ; 46.51,67.74 48.26,67.74 48.51,68 48.51,68.61 R21.1 ; 46.51,67.74 44.83,67.74 ; 46.51,67.74 D40.1 ; 44.83,67.74 43.2,67.74 ; 43.2,67.74 43.2,68.54 D39.1 ; 43.2,67.74 41.52,67.74 ; U17.5 v1(23.29,24.69) ; 48.46,68.66 48.48,68.68
  Bottom Layer w0.203: v1(29.46,35.1) 29.46,33.73 27.92,32.18 26.16,32.18 25.73,31.75 25.73,25.27 25.15,24.69 v1(23.29,24.69)
IROM5: length 92.2
  Top Layer w0.203: 55.42,67.74 53.82,67.74 ; 55.42,67.74 55.46,67.78 D45.1 ; 55.42,67.74 57.13,67.74 ; 53.82,67.74 52.12,67.74 ; 53.82,67.74 53.79,67.77 D42.1 ; 60.4,67.74 60.47,67.81 D46.1 ; 60.4,67.74 58.76,67.74 ; 60.4,67.74 62.13,67.74 ; 52.12,67.74 50.45,67.74 ; 52.12,67.74 52.12,67.75 D43.1 ; 50.45,67.74 D41.1 ; 50.45,67.74 49.53,67.74 49.02,67.23 33.4,67.23 32.77,66.6 32.77,56.57 30.1,53.9 v1(30.1,34.47) ; 58.76,67.74 57.13,67.74 ; 58.76,67.74 58.8,67.78 D47.1 ; 57.13,67.74 57.13,68.56 D44.1 ; 27.01,23.42 v1(23.29,23.42) ; 62.13,67.74 62.13,67.75 D48.1 ; 62.13,67.74 63.75,67.74 64.04,68.03 R22.1
  Bottom Layer w0.203: v1(30.1,34.47) 30.1,33.58 28.07,31.55 26.67,31.55 26.29,31.17 26.29,23.93 25.78,23.42 v1(23.29,23.42)
IROM6: length 108.7
  Top Layer w0.203: D54.1 75.96,67.72 ; 75.96,67.72 77.62,67.72 ; 75.96,67.72 74.29,67.72 ; 74.29,67.72 74.29,68.56 D55.1 ; 74.29,67.72 72.62,67.72 ; 77.62,67.72 79.3,67.72 79.6,68.01 R23.1 ; 77.62,67.72 D56.1 ; D50.1 69.3,68.54 69.3,67.72 ; 70.95,67.72 72.62,67.72 ; 70.95,67.72 D53.1 ; 70.95,67.72 69.3,67.72 ; 72.62,67.72 D52.1 ; 65.92,67.72 65.12,67.72 64.52,67.11 50.29,67.11 49.91,66.73 33.91,66.73 33.27,66.09 33.27,56.44 30.73,53.9 v1(30.73,35.1) ; 65.92,67.72 65.94,67.74 D49.1 ; 65.92,67.72 67.61,67.72 ; 79.58,68.66 79.6,68.68 ; D51.1 67.61,67.72 ; 67.61,67.72 69.3,67.72 ; U17.7 v1(23.29,22.15)
  Bottom Layer w0.203: v1(23.29,22.15) 26.16,22.15 26.92,22.91 26.92,30.66 27.18,30.91 28.19,30.91 30.71,33.43 30.71,35.08 v1(30.73,35.1)
IROM7: length 126.6
  Top Layer w0.203: D63.1 89.91,67.49 ; 89.91,67.49 91.58,67.49 ; 89.91,67.49 88.25,67.49 ; v1(31.35,34.49) 31.35,53.83 33.78,56.26 33.78,65.58 34.46,66.26 50.84,66.26 51.05,66.47 65.25,66.47 65.76,66.98 80,66.98 80.51,67.49 81.57,67.49 ; 81.57,67.49 D57.1 ; 81.57,67.49 83.24,67.49 ; 84.93,67.49 84.93,68.54 D59.1 ; 84.93,67.49 83.24,67.49 ; 84.93,67.49 86.57,67.49 ; 83.24,67.49 D58.1 ; 91.58,67.49 93.25,67.49 ; 91.58,67.49 D62.1 ; 86.57,67.49 88.25,67.49 ; 86.57,67.49 D61.1 ; 88.25,67.49 88.25,68.56 D60.1 ; 93.25,67.49 94.96,67.49 95.25,67.78 R24.1 ; 93.25,67.49 D64.1 ; U17.8 v1(23.29,20.88)
  Bottom Layer w0.203: v1(31.35,34.49) 31.35,33.3 27.62,29.58 27.62,21.83 26.67,20.88 v1(23.29,20.88)
IROM8: length 66
  Top Layer w0.203: D72.1 46.51,52.01 46.53,51.99 ; 43.17,51.99 46.53,51.99 ; 43.17,51.99 43.18,52 D70.1 ; 43.17,51.99 41.5,51.99 ; D65.1 34.83,52 34.83,51.99 ; 46.53,51.99 48.13,51.99 48.48,52.34 R25.1 ; D69.1 41.51,52 41.5,51.99 ; D66.1 38.19,52.84 38.19,51.99 ; 39.85,51.99 39.84,52 D68.1 ; 39.85,51.99 41.5,51.99 ; 39.85,51.99 38.19,51.99 ; U17.9 v1(23.29,19.61) ; 38.19,51.99 36.49,51.99 ; D71.1 44.84,52 ; 36.49,51.99 36.5,52 D67.1 ; 36.49,51.99 34.83,51.99 ; 34.83,51.99 32.89,51.99 31.99,51.09 v1(31.99,35.1)
  Bottom Layer w0.203: v1(31.99,35.1) 31.95,35.07 31.95,33.15 28.32,29.51 28.32,20.37 27.56,19.61 v1(23.29,19.61)
IROM9: length 82.5
  Top Layer w0.203: 57.12,51.99 58.79,51.99 ; 57.12,51.99 57.13,52 D76.1 ; 57.12,51.99 55.46,51.99 ; 58.79,51.99 60.48,51.99 ; 58.79,51.99 58.8,52 D79.1 ; 53.77,51.99 55.46,51.99 ; 53.77,51.99 52.14,51.99 ; 53.77,51.99 53.79,52.01 D74.1 ; 55.46,51.99 55.46,52 D77.1 ; 62.12,51.99 63.63,51.99 64.04,52.41 R26.1 ; 62.12,51.99 62.13,52 D80.1 ; 62.12,51.99 60.48,51.99 ; U17.10 v1(23.29,18.34) ; D78.1 60.47,52 60.48,51.99 ; 52.14,51.99 52.14,52.84 D75.1 ; 52.14,51.99 50.45,51.99 ; 50.45,51.99 D73.1 ; 50.45,51.99 49.53,51.99 49.02,51.49 33.53,51.49 32.62,50.58 v1(32.62,34.47)
  Bottom Layer w0.203: v1(32.62,34.47) 32.62,32.93 28.96,29.26 28.96,19.1 28.19,18.34 v1(23.29,18.34)
IROM10: length 97.9
  Top Layer w0.203: v1(33.38,35.1) 33.38,50.07 34.29,50.98 49.66,50.98 50.04,51.36 64.39,51.36 65.15,52.12 65.97,52.12 ; U17.11 v1(23.29,17.07) ; 77.65,52.12 79.25,52.12 79.6,52.47 R27.1 ; 77.65,52.12 77.62,52.15 D88.1 ; 77.65,52.12 75.99,52.12 ; 65.97,52.12 65.94,52.15 D81.1 ; 65.97,52.12 67.61,52.12 ; 72.63,52.12 70.92,52.12 ; 72.63,52.12 72.62,52.14 D84.1 ; 72.63,52.12 74.27,52.12 ; 70.92,52.12 70.95,52.15 D85.1 ; 70.92,52.12 69.26,52.12 ; D82.1 69.28,52.14 69.26,52.12 ; 69.26,52.12 67.61,52.12 ; 67.61,52.12 67.61,52.12 D83.1 ; 74.27,52.12 74.29,52.14 D87.1 ; 74.27,52.12 75.99,52.12 ; D86.1 75.96,52.16 75.99,52.12
  Bottom Layer w0.203: v1(33.38,35.1) 33.38,32.92 29.59,29.13 29.59,17.96 28.7,17.07 v1(23.29,17.07)
